# Altium project CPU_Board_V1_2.PrjPcb (part 2 of 2)

## Sheet Peripherial_Bus.SchDoc: Peripheral Bus
size Tabloid; Date: 03/13/2023; Engineer: Terry D. Schevker; Revision: 1.0; SheetNumber: 4; SheetTotal: 8
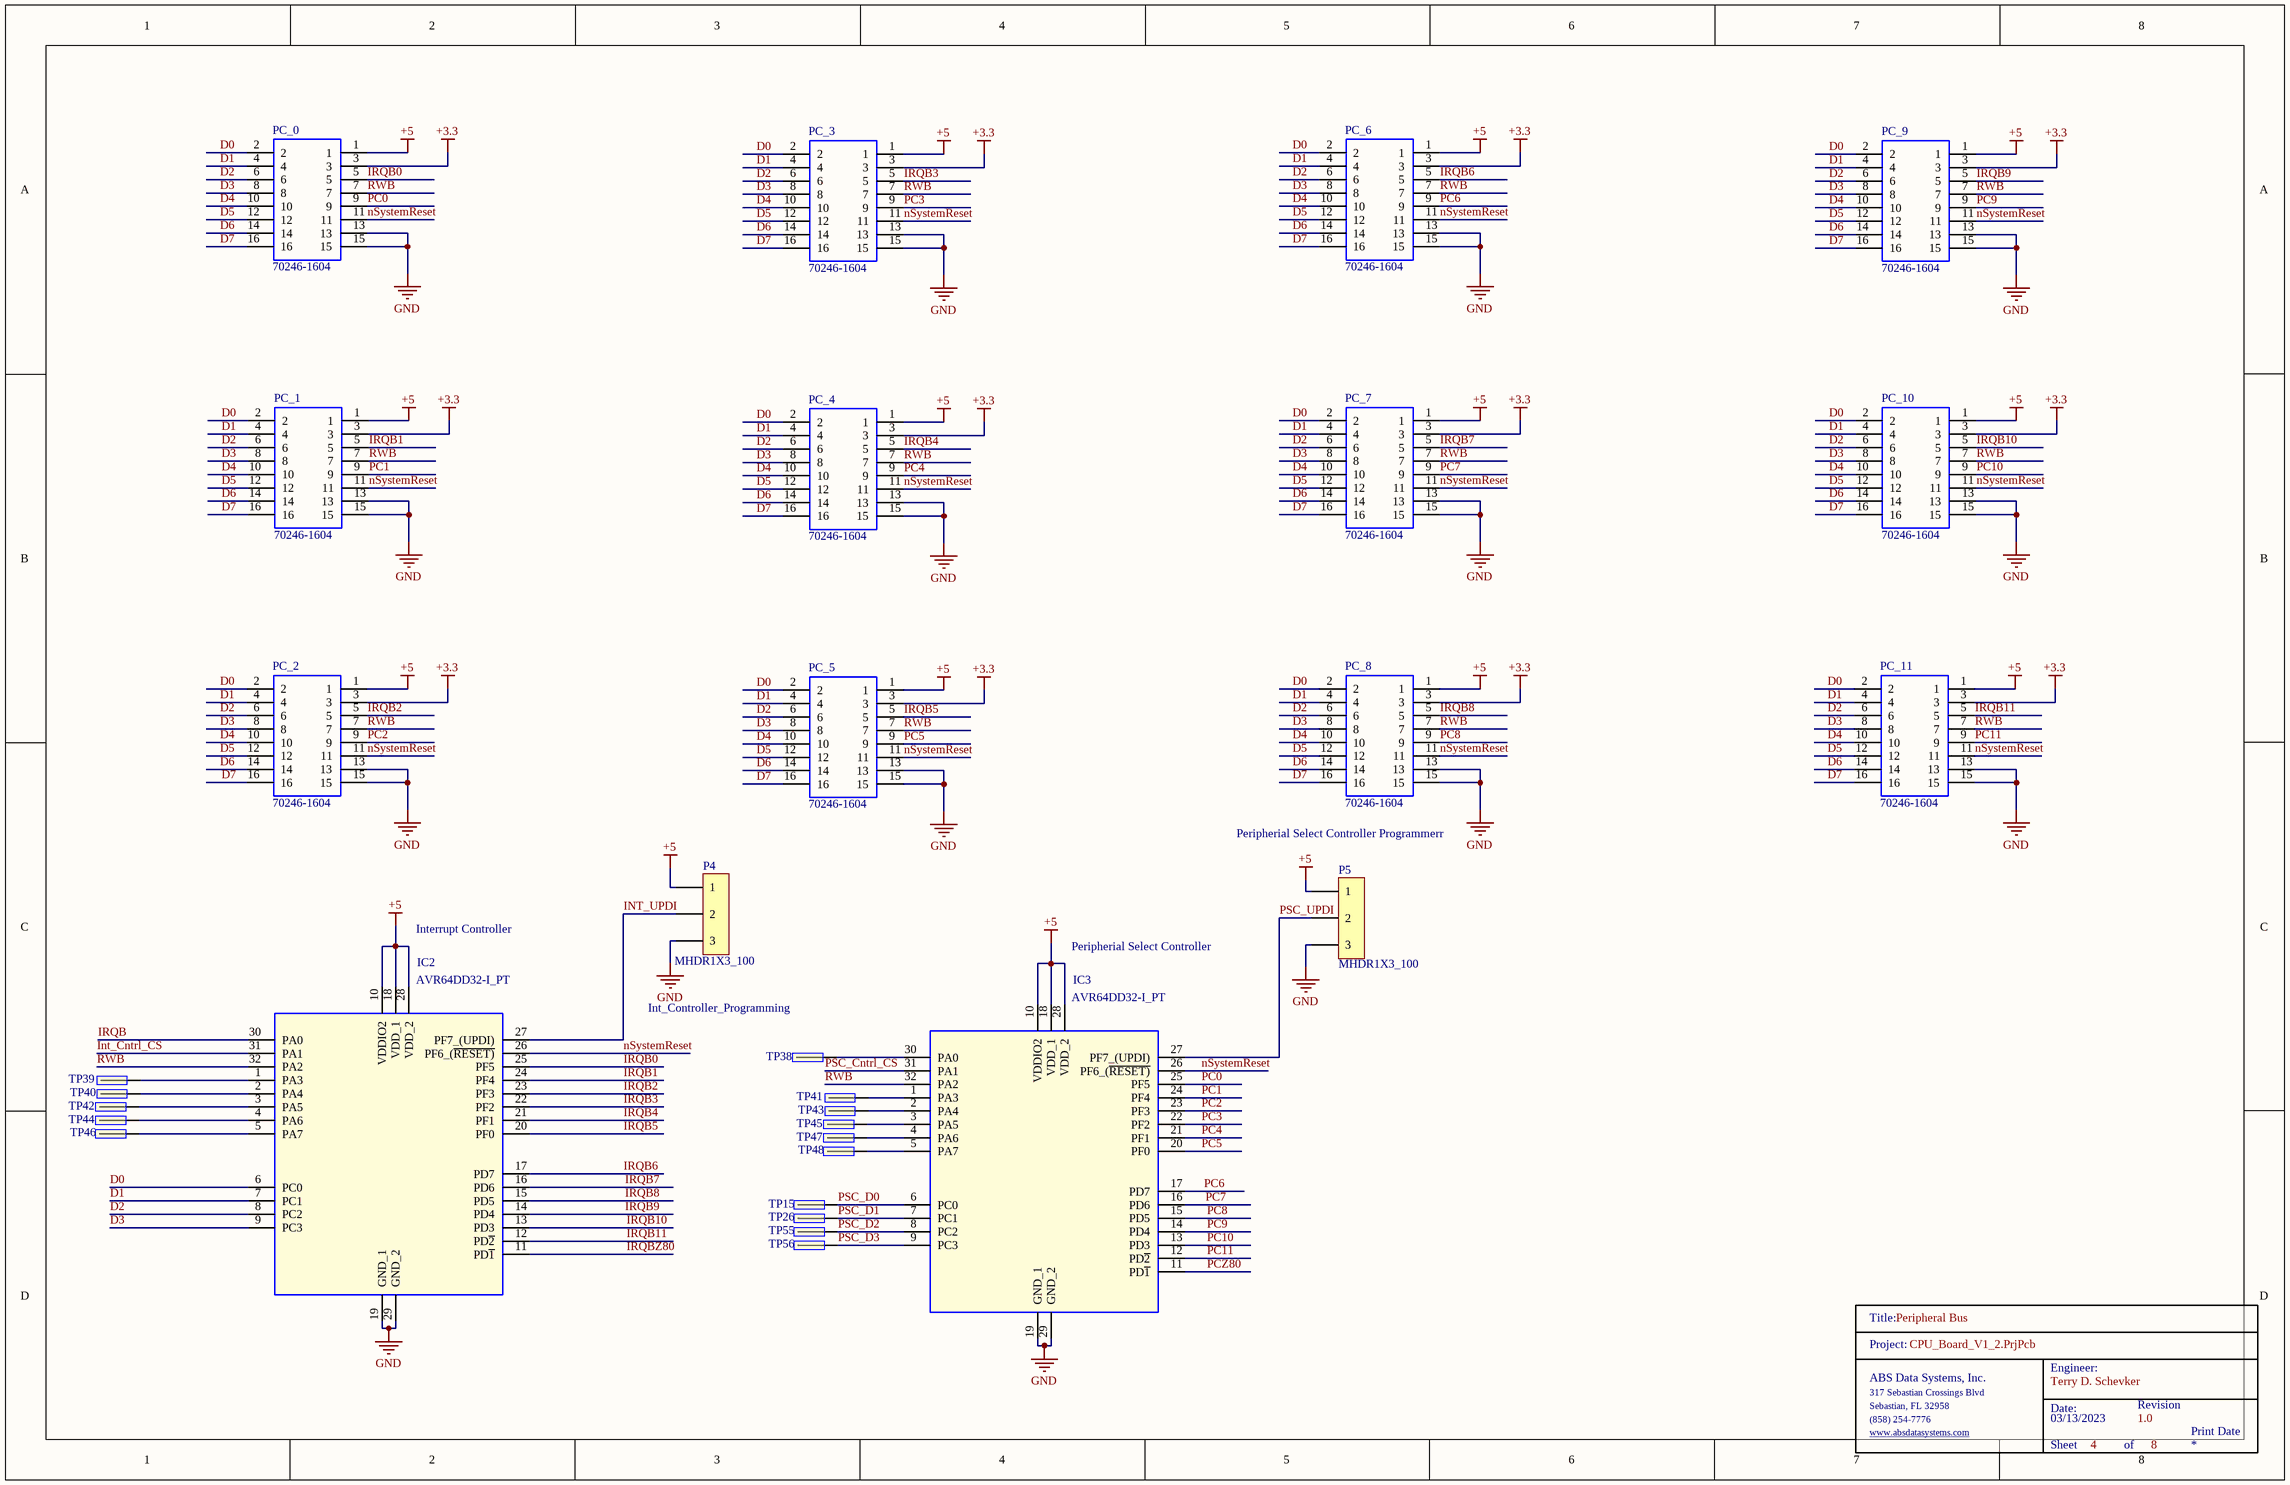
[diagram p3: Peripherial_Bus.SchDoc]

### Parts
(Parts that share a designator on the sheet are numbered #1, #2 ... from top to bottom, then left to right.)
IC2  AVR64DD32-I_PT  [QFP80P900X900X120-32N]
IC3  AVR64DD32-I_PT  [QFP80P900X900X120-32N]
P4  MHDR1X3_100  [MHDR1X3_100]
P5  MHDR1X3_100  [MHDR1X3_100]
PC_0  70246-1604  [SHDR16W99P254_2X8_2794X889X927P]
PC_1  70246-1604  [SHDR16W99P254_2X8_2794X889X927P]
PC_2  70246-1604  [SHDR16W99P254_2X8_2794X889X927P]
PC_3  70246-1604  [SHDR16W99P254_2X8_2794X889X927P]
PC_4  70246-1604  [SHDR16W99P254_2X8_2794X889X927P]
PC_5  70246-1604  [SHDR16W99P254_2X8_2794X889X927P]
PC_6  70246-1604  [SHDR16W99P254_2X8_2794X889X927P]
PC_7  70246-1604  [SHDR16W99P254_2X8_2794X889X927P]
PC_8  70246-1604  [SHDR16W99P254_2X8_2794X889X927P]
PC_9  70246-1604  [SHDR16W99P254_2X8_2794X889X927P]
PC_10  70246-1604  [SHDR16W99P254_2X8_2794X889X927P]
PC_11  70246-1604  [SHDR16W99P254_2X8_2794X889X927P]
TitleBlock_6#1  TitleBlock  (value not drawn)  (graphical)
TP15  TP  [TP]  (value not drawn)
TP26  TP  [TP]  (value not drawn)
TP38  TP  [TP]  (value not drawn)
TP39  TP  [TP]  (value not drawn)
TP40  TP  [TP]  (value not drawn)
TP41  TP  [TP]  (value not drawn)
TP42  TP  [TP]  (value not drawn)
TP43  TP  [TP]  (value not drawn)
TP44  TP  [TP]  (value not drawn)
TP45  TP  [TP]  (value not drawn)
TP46  TP  [TP]  (value not drawn)
TP47  TP  [TP]  (value not drawn)
TP48  TP  [TP]  (value not drawn)
TP55  TP  [TP]  (value not drawn)
TP56  TP  [TP]  (value not drawn)

### Nets
+3.3: PC_0.3 PC_1.3 PC_2.3 PC_3.3 PC_4.3 PC_5.3 PC_6.3 PC_7.3 PC_8.3 PC_9.3 PC_10.3 PC_11.3
+5: IC2.10(VDDIO2) IC2.18(VDD_1) IC2.28(VDD_2) IC3.10(VDDIO2) IC3.18(VDD_1) IC3.28(VDD_2) P4.1 P5.1 PC_0.1 PC_1.1 PC_2.1 PC_3.1 PC_4.1 PC_5.1 PC_6.1 PC_7.1 PC_8.1 PC_9.1 PC_10.1 PC_11.1
GND: IC2.19(GND_1) IC2.29(GND_2) IC3.19(GND_1) IC3.29(GND_2) P4.3 P5.3 PC_0.13 PC_0.15 PC_1.13 PC_1.15 PC_2.13 PC_2.15 PC_3.13 PC_3.15 PC_4.13 PC_4.15 PC_5.13 PC_5.15 PC_6.13 PC_6.15 PC_7.13 PC_7.15 PC_8.13 PC_8.15 PC_9.13 PC_9.15 PC_10.13 PC_10.15 PC_11.13 PC_11.15
D0: IC2.6(PC0) PC_0.2 PC_1.2 PC_2.2 PC_3.2 PC_4.2 PC_5.2 PC_6.2 PC_7.2 PC_8.2 PC_9.2 PC_10.2 PC_11.2
D1: IC2.7(PC1) PC_0.4 PC_1.4 PC_2.4 PC_3.4 PC_4.4 PC_5.4 PC_6.4 PC_7.4 PC_8.4 PC_9.4 PC_10.4 PC_11.4
D2: IC2.8(PC2) PC_0.6 PC_1.6 PC_2.6 PC_3.6 PC_4.6 PC_5.6 PC_6.6 PC_7.6 PC_8.6 PC_9.6 PC_10.6 PC_11.6
D3: IC2.9(PC3) PC_0.8 PC_1.8 PC_2.8 PC_3.8 PC_4.8 PC_5.8 PC_6.8 PC_7.8 PC_8.8 PC_9.8 PC_10.8 PC_11.8
D4: PC_0.10 PC_1.10 PC_2.10 PC_3.10 PC_4.10 PC_5.10 PC_6.10 PC_7.10 PC_8.10 PC_9.10 PC_10.10 PC_11.10
D5: PC_0.12 PC_1.12 PC_2.12 PC_3.12 PC_4.12 PC_5.12 PC_6.12 PC_7.12 PC_8.12 PC_9.12 PC_10.12 PC_11.12
D6: PC_0.14 PC_1.14 PC_2.14 PC_3.14 PC_4.14 PC_5.14 PC_6.14 PC_7.14 PC_8.14 PC_9.14 PC_10.14 PC_11.14
D7: PC_0.16 PC_1.16 PC_2.16 PC_3.16 PC_4.16 PC_5.16 PC_6.16 PC_7.16 PC_8.16 PC_9.16 PC_10.16 PC_11.16
Int_Cntrl_CS: IC2.31(PA1)
INT_UPDI: IC2.27(PF7_(UPDI)) P4.2
IRQB: IC2.30(PA0)
IRQB0: IC2.25(PF5) PC_0.5
IRQB1: IC2.24(PF4) PC_1.5
IRQB2: IC2.23(PF3) PC_2.5
IRQB3: IC2.22(PF2) PC_3.5
IRQB4: IC2.21(PF1) PC_4.5
IRQB5: IC2.20(PF0) PC_5.5
IRQB6: IC2.17(PD7) PC_6.5
IRQB7: IC2.16(PD6) PC_7.5
IRQB8: IC2.15(PD5) PC_8.5
IRQB9: IC2.14(PD4) PC_9.5
IRQB10: IC2.13(PD3) PC_10.5
IRQB11: IC2.12(PD~{2}) PC_11.5
IRQBZ80: IC2.11(PD~{1})
nSystemReset: IC2.26(PF6_(~{RESET)}) IC3.26(PF6_(~{RESET)}) PC_0.11 PC_1.11 PC_2.11 PC_3.11 PC_4.11 PC_5.11 PC_6.11 PC_7.11 PC_8.11 PC_9.11 PC_10.11 PC_11.11
PC0: IC3.25(PF5) PC_0.9
PC1: IC3.24(PF4) PC_1.9
PC2: IC3.23(PF3) PC_2.9
PC3: IC3.22(PF2) PC_3.9
PC4: IC3.21(PF1) PC_4.9
PC5: IC3.20(PF0) PC_5.9
PC6: IC3.17(PD7) PC_6.9
PC7: IC3.16(PD6) PC_7.9
PC8: IC3.15(PD5) PC_8.9
PC9: IC3.14(PD4) PC_9.9
PC10: IC3.13(PD3) PC_10.9
PC11: IC3.12(PD~{2}) PC_11.9
PCZ80: IC3.11(PD~{1})
PSC_Cntrl_CS: IC3.31(PA1)
PSC_D0: IC3.6(PC0) TP15.1
PSC_D1: IC3.7(PC1) TP26.1
PSC_D2: IC3.8(PC2) TP55.1
PSC_D3: IC3.9(PC3) TP56.1
PSC_UPDI: IC3.27(PF7_(UPDI)) P5.2
RWB: IC2.32(PA2) IC3.32(PA2) PC_0.7 PC_1.7 PC_2.7 PC_3.7 PC_4.7 PC_5.7 PC_6.7 PC_7.7 PC_8.7 PC_9.7 PC_10.7 PC_11.7
NetIC2_1: IC2.1(PA3) TP39.1
NetIC2_2: IC2.2(PA4) TP40.1
NetIC2_3: IC2.3(PA5) TP42.1
NetIC2_4: IC2.4(PA6) TP44.1
NetIC2_5: IC2.5(PA7) TP46.1
NetIC3_1: IC3.1(PA3) TP41.1
NetIC3_2: IC3.2(PA4) TP43.1
NetIC3_3: IC3.3(PA5) TP45.1
NetIC3_4: IC3.4(PA6) TP47.1
NetIC3_5: IC3.5(PA7) TP48.1
NetIC3_30: IC3.30(PA0) TP38.1

### Notes on the sheet
- Peripherial Select Controller Programmerr
- Interrupt Controller
- Peripherial Select Controller
- Int_Controller_Programming
- Print Date
- (in symbol TitleBlock) Title:; Project:; Engineer:; ABS Data Systems, Inc.; 317 Sebastian Crossings Blvd; Sebastian, FL 32958; Date:; Revision; (858) 254-7776; www.absdatasystems.com; Sheet; of

### Library data of the parts
IC2 IC3 = AVR64DD32-I_PT: Integrated Circuit; Manufacturer_Name: Microchip; Manufacturer_Part_Number: AVR64DD32-I/PT | MULTI-VOLTAGE I/O; Datasheet Link: https://www.microchip.com/en-us/product/AVR64DD32; Height: 1.2mm
P4 P5 = MHDR1X3_100: Header, 3-Pin; LatestRevisionDate: 17-Jul-2002; LatestRevisionNote: Re-released for DXP Platform.; Publisher: Altium Limited
PC_0-PC_11 = 70246-1604: Molex C-GRID 70246, 2.54mm Pitch, 16 Way, 2 Row, Straight PCB Header, Through Hole; Geometry.Height: 9.27mm; Mouser Part Number: 538-70246-1604; Mouser Price/Stock: https://www.mouser.co.uk/ProductDetail/Molex/70246-1604?qs=KUIzHt%2Fe91njhb67Cjmalw%3D%3D; Manufacturer_Name: Molex; Manufacturer_Part_Number: 70246-1604; Datasheet Link: https://www.molex.com/pdm_docs/sd/702461604_sd.pdf
TP15 TP26 TP38-TP48 TP55 TP56 = TP: Manufacturer: Samtec; Manufacturer Part Number: TST-105-01-G-D; Number of Contacts: 16; Gender: Male; Connector Type: Male Pin; Pitch: 2.54mm; Row Spacing: 0.1inch; Supplier 1: Digi-Key; RoHS: Yes; Category: Headers and Wire Housings; Stock 1: 227; Pricing 1: 1=2.85000, 10=2.73600, 100=2.28000, 500=1.93800, 1000=1.65300, 5000=1.48200 (USD); Mount: Through Hole; Contact Plating: Gold; Contact Material: Bronze; Housing Material: Polyester; Housing Color: Black; Color: Black; Min Operating Temperature: -55°C; Max Operating Temperature: 125°C; Number of Rows: 2; Termination: Solder; Packaging: Rail/Tube; Orientation: Straight; Number of Positions: 16; Length: 27.94mm; Depth: 9.27mm; Contact Mating Length: 0.25inch; REACH SVHC: No SVHC; ComponentLink1URL: https://datasheet.ciiva.com/739/tst-mkt-739845.pdf?src-supplier=Digi-Key; ComponentLink1Description: https://datasheet.ciiva.com/739/tst-mkt-739845.pdf?src-supplier=Digi-Key; ComponentLink2URL: https://datasheet.ciiva.com/10018/htst-10018510.pdf?src-supplier=Avnet; ComponentLink2Description: https://datasheet.ciiva.com/10018/htst-10018510.pdf?src-supplier=Avnet

## Sheet PowerSupply.SchDoc: Power Board
size Tabloid; Date: 12/20/2022; Engineer: Terry D. Schevker; Revision: 1.0; SheetNumber: 5; SheetTotal: 8
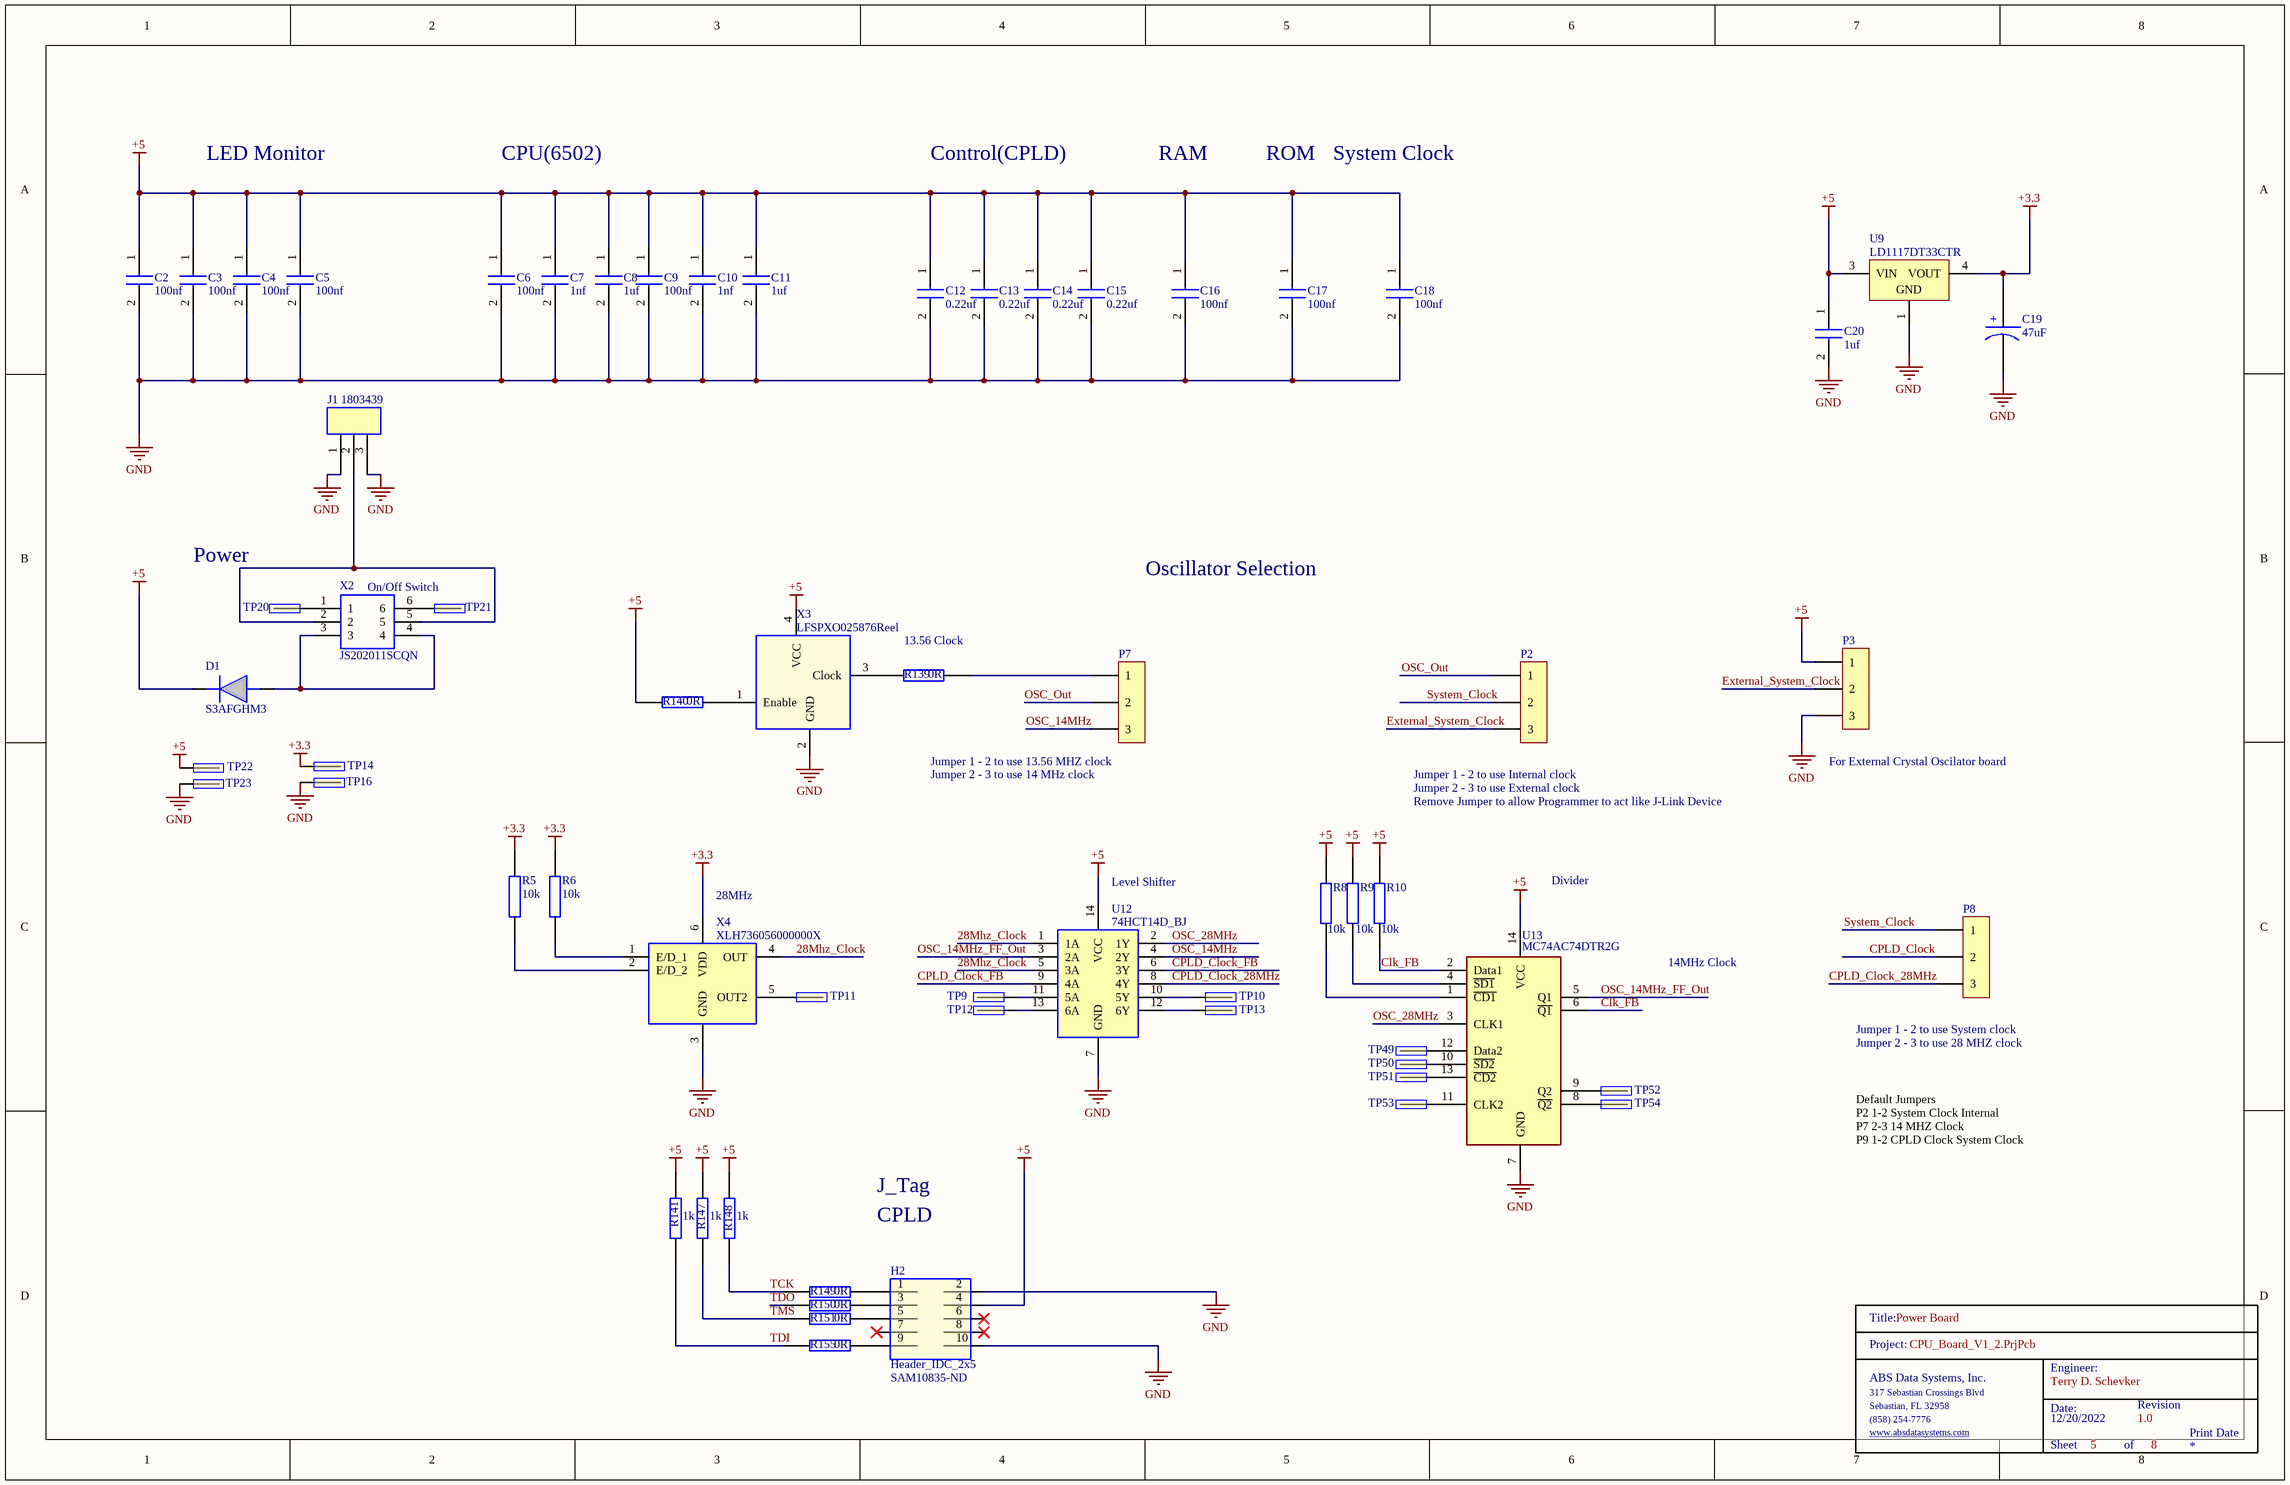
[diagram p4: PowerSupply.SchDoc]

### Parts
C2  100nf  [0603]
C3  100nf  [0603]
C4  100nf  [0603]
C5  100nf  [0603]
C6  100nf  [0603]
C7  1nf  [0603]
C8  1uf  [0603]
C9  100nf  [0603]
C10  1nf  [0603]
C11  1uf  [0603]
C12  0.22uf  [0603]
C13  0.22uf  [0603]
C14  0.22uf  [0603]
C15  0.22uf  [0603]
C16  100nf  [0603]
C17  100nf  [0603]
C18  100nf  [0603]
C19  47uF  [CapSMD_6.3x5.8]
C20  1uf  [0603]
D1  S3AFGHM3  [do-221ac]
H2  Header_IDC_2x5  Supplier Part Number 1: SAM10835-ND  [HDR2X5]
J1  1803439  [1803439]
P2  MHDR1X3_100  [MHDR1X3_100]  (value not drawn)
P3  MHDR1X3_100  [MHDR1X3_100]  (value not drawn)
P7  MHDR1X3_100  [MHDR1X3_100]  (value not drawn)
P8  MHDR1X3_100  [MHDR1X3_100]  (value not drawn)
R5  10k  [0603]
R6  10k  [0603]
R8  10k  [0603]
R9  10k  [0603]
R10  10k  [0603]
R139  0R  [0603]
R140  0R  [0603]
R141  1k  [0603]
R147  1k  [0603]
R148  1k  [0603]
R149  0R  [0603]
R150  0R  [0603]
R151  0R  [0603]
R155  0R  [0603]
TitleBlock_3  TitleBlock  (value not drawn)  (graphical)
TP9  (no value)  [TP]
TP10  TP  [TP]  (value not drawn)
TP11  TP  [TP]  (value not drawn)
TP12  (no value)  [TP]
TP13  TP  [TP]  (value not drawn)
TP14  TP  [TP]  (value not drawn)
TP16  TP  [TP]  (value not drawn)
TP20  (no value)  [TP]
TP21  (no value)  [TP]
TP22  TP  [TP]  (value not drawn)
TP23  TP  [TP]  (value not drawn)
TP49  TP  [TP]  (value not drawn)
TP50  TP  [TP]  (value not drawn)
TP51  TP  [TP]  (value not drawn)
TP52  TP  [TP]  (value not drawn)
TP53  TP  [TP]  (value not drawn)
TP54  TP  [TP]  (value not drawn)
U9  LD1117DT33CTR  [TO-252_N]
U12  74HCT14D_BJ  [SOIC127P600X175-14N]
U13  MC74AC74DTR2G  [SOP65P640X120-14N]
X2  JS202011SCQN  [JS202011SCQN]
X3  LFSPXO025876Reel  [LFSPXO025876Reel]
X4  XLH736056000000X  [XLH736056000000X]

### Nets
+3.3: C19.1 R5.2 R6.2 TP14.1 U9.4(VOUT) X4.6(VDD)
+5: C2.1 C3.1 C4.1 C5.1 C6.1 C7.1 C8.1 C9.1 C10.1 C11.1 C12.1 C13.1 C14.1 C15.1 C16.1 C17.1 C18.1 C20.1 D1.1(K) H2.4 P3.1 R8.2 R9.2 R10.2 R140.1 R141.1 R147.1 R148.1 TP22.1 U9.3(VIN) U12.14(VCC) U13.14(VCC) X3.4(VCC)
GND: C2.2 C3.2 C4.2 C5.2 C6.2 C7.2 C8.2 C9.2 C10.2 C11.2 C12.2 C13.2 C14.2 C15.2 C16.2 C17.2 C18.2 C19.2 C20.2 H2.2 H2.10 J1.1 J1.3 P3.3 TP16.1 TP23.1 U9.1(GND) U12.7(GND) U13.7(GND) X3.2(GND) X4.3(GND)
28Mhz_Clock: U12.1(1A) U12.5(3A) X4.4(OUT)
Clk_FB: R10.1 U13.2(Data1) U13.6(~{Q1})
CPLD_Clock: P8.2
CPLD_Clock_28MHz: P8.3 U12.8(4Y)
CPLD_Clock_FB: U12.6(3Y) U12.9(4A)
External_System_Clock: P2.3 P3.2
OSC_14MHz: P7.3 U12.4(2Y)
OSC_14MHz_FF_Out: U12.3(2A) U13.5(Q1)
OSC_28MHz: U12.2(1Y) U13.3(CLK1)
OSC_Out: P2.1 P7.2
System_Clock: P2.2 P8.1
TCK: R148.2 R149.1
TDI: R141.2 R155.1
TDO: R150.1
TMS: R147.2 R151.1
NetD1_2: D1.2(A) X2.3 X2.4
NetH2_1: H2.1 R149.2
NetH2_3: H2.3 R150.2
NetH2_5: H2.5 R151.2
NetH2_9: H2.9 R155.2
NetJ1_2: J1.2 X2.2 X2.5
NetP7_1: P7.1 R139.2
NetR5_1: R5.1 X4.2(E/D_2)
NetR6_1: R6.1 X4.1(E/D_1)
NetR8_1: R8.1 U13.1(~{CD1})
NetR9_1: R9.1 U13.4(~{SD1})
NetR139_1: R139.1 X3.3(Clock)
NetR140_2: R140.2 X3.1(Enable)
NetTP9_1: TP9.1 U12.11(5A)
NetTP10_1: TP10.1 U12.10(5Y)
NetTP11_1: TP11.1 X4.5(OUT2)
NetTP12_1: TP12.1 U12.13(6A)
NetTP13_1: TP13.1 U12.12(6Y)
NetTP20_1: TP20.1 X2.1
NetTP21_1: TP21.1 X2.6
NetTP49_1: TP49.1 U13.12(Data2)
NetTP50_1: TP50.1 U13.10(~{SD2})
NetTP51_1: TP51.1 U13.13(~{CD2})
NetTP52_1: TP52.1 U13.9(Q2)
NetTP53_1: TP53.1 U13.11(CLK2)
NetTP54_1: TP54.1 U13.8(~{Q2})

Not connected (* = marked no-connect by the designer): H2 6* 7* 8*

### Notes on the sheet
- LED Monitor
- CPU(6502)
- Control(CPLD)
- RAM
- ROM
- System Clock
- (near TP20) Power
- On/Off Switch
- Oscillator Selection
- (near R139) 13.56 Clock
- (near P7) Jumper 1 - 2 to use 13.56 MHZ clock
- (near P3) For External Crystal Oscilator board
- (near P7) Jumper 2 - 3 to use 14 MHz clock
- (near P2) Jumper 1 - 2 to use Internal clock
- Remove Jumper to allow Programmer to act like J-Link Device
- Jumper 2 - 3 to use External clock
- (near X4) 28MHz
- (near U12) Level Shifter
- Divider
- 14MHz Clock
- (near P8) Jumper 1 - 2 to use System clock
- Jumper 2 - 3 to use 28 MHZ clock
- Default Jumpers
  P2 1-2 System Clock Internal
  P7 2-3 14 MHZ Clock
  P9 1-2 CPLD Clock System Clock
- J_Tag
- CPLD
- Print Date
- (in symbol TitleBlock) Title:; Project:; Engineer:; ABS Data Systems, Inc.; 317 Sebastian Crossings Blvd; Sebastian, FL 32958; Date:; Revision; (858) 254-7776; www.absdatasystems.com; Sheet; of
- (in symbol UUD1C470MCL1GS) +

### Library data of the parts
C2-C6 C9 C12-C18 = CL10B104JB8NNNC: Samsung Electro-Mechanics 0603 100nf
C7 C10 = CL10B102KB8NNNL: Samsung Electro-Mechanics 0603 1nf
C8 C11 C20 = CL10B105KA8NNNL: Samsung Electro-Mechanics 0603 1uf
C19 = UUD1C470MCL1GS: CAP ALUM 47UF 20% 16V SMD; Manufacturer: Nichicon; Dielectric Material: Aluminium; Ripple Current: 230mA; Impedance: 440mR; Leakage Current: 3uA; Life (Hours): 2000Hour; Dissipation Factor: 0.2%; Lead Diameter: 0.8mm; Supplier 1: Digi-Key; Manufacturer Part Number: UUD1C470MCL1GS; RoHS: Yes; Category: Aluminum Electrolytic Capacitors; Stock 1: 26327; Pricing 1: 1=0.50000, 10=0.34600, 50=0.24220, 100=0.20760, 500=0.15568 (USD); Case/Package: Radial; Number of Pins: 2; Contact Plating: Tin; Min Operating Temperature: -55°C; Max Operating Temperature: 105°C; Tolerance: 20%; Capacitance: 47uF; Package Quantity: 1000; Voltage Rating (DC): 16V; Packaging: Tape and Reel; Voltage Rating: 16V; Ripple Current (AC): 230mA; Termination: SMD/SMT; Voltage: 16V; Diameter: 6.3mm; Length: 5.8mm; Height: 5.8mm; Lead Pitch: 2.2mm; Height - Seated (Max): 0.228inch; Radiation Hardening: No; REACH SVHC: No SVHC; Lead Free: Lead Free; ComponentLink1URL: https://datasheet.ciiva.com/30522/getdatasheetpartid-449848-30522051.pdf?src-supplier=Verical; ComponentLink1Description: https://datasheet.ciiva.com/30522/getdatasheetpartid-449848-30522051.pdf?src-supplier=Verical; ComponentLink2URL: https://datasheet.ciiva.com/96/e-ud-96997.pdf?src-supplier=Digi-Key; ComponentLink2Description: https://datasheet.ciiva.com/96/e-ud-96997.pdf?src-supplier=Digi-Key; ComponentLink3URL: https://datasheet.ciiva.com/11776/0900766b80fa39e7-11776889.pdf?src-supplier=RSComponents; ComponentLink3Description: https://datasheet.ciiva.com/11776/0900766b80fa39e7-11776889.pdf?src-supplier=RSComponents; ComponentLink4URL: https://datasheet.ciiva.com/96/e-ud-96998.pdf?src-supplier=Digi-Key; ComponentLink4Description: https://datasheet.ciiva.com/96/e-ud-96998.pdf?src-supplier=Digi-Key; ComponentLink5URL: https://datasheet.ciiva.com/96/e-ud-96999.pdf?src-supplier=Digi-Key; ComponentLink5Description: https://datasheet.ciiva.com/96/e-ud-96999.pdf?src-supplier=Digi-Key; ComponentLink6URL: https://datasheet.ciiva.com/11686/e-ud-11686236.pdf?src-supplier=Avnet; ComponentLink6Description: https://datasheet.ciiva.com/11686/e-ud-11686236.pdf?src-supplier=Avnet; ComponentLink7URL: https://datasheet.ciiva.com/16502/e-ud-16502750.pdf?src-supplier=Future+Electronics; ComponentLink7Description: https://datasheet.ciiva.com/16502/e-ud-16502750.pdf?src-supplier=Future+Electronics; ComponentLink8URL: https://datasheet.ciiva.com/7781/e-ud-7781695.pdf?src-supplier=Element14; ComponentLink8Description: https://datasheet.ciiva.com/7781/e-ud-7781695.pdf?src-supplier=Element14; Supplier Part Number 1: 493-2259-1-ND
D1 = S3AFGHM3/I: Rectifiers VR=400V, IO=3A; Manufacturer_Name: Comchip Technology; Manufacturer_Part_Number: 1N4001-G; Mouser Part Number: 750-1N4001-G; Mouser Price/Stock: https://www.mouser.co.uk/ProductDetail/Comchip-Technology/1N4001-G?qs=2qJf6qQ4IOKJYZQUWvVExw%3D%3D; Datasheet Link: https://datasheet.datasheetarchive.com/originals/distributors/Datasheets-7/DSA-138621.pdf
H2 = Header_IDC_2x5: 10 Pin 2x5 Through Hold IDC Connector; Manufacturer: Samtec; Manufacturer Part Number: TST-105-01-G-D; Number of Contacts: 16; Gender: Male; Connector Type: Male Pin; Pitch: 2.54mm; Row Spacing: 0.1inch; Supplier 1: Digi-Key; RoHS: Yes; Category: Headers and Wire Housings; Stock 1: 227; Pricing 1: 1=2.85000, 10=2.73600, 100=2.28000, 500=1.93800, 1000=1.65300, 5000=1.48200 (USD); Mount: Through Hole; Contact Plating: Gold; Contact Material: Bronze; Housing Material: Polyester; Housing Color: Black; Color: Black; Min Operating Temperature: -55°C; Max Operating Temperature: 125°C; Number of Rows: 2; Termination: Solder; Packaging: Rail/Tube; Orientation: Straight; Number of Positions: 16; Length: 27.94mm; Depth: 9.27mm; Contact Mating Length: 0.25inch; REACH SVHC: No SVHC; ComponentLink1URL: https://datasheet.ciiva.com/739/tst-mkt-739845.pdf?src-supplier=Digi-Key; ComponentLink1Description: https://datasheet.ciiva.com/739/tst-mkt-739845.pdf?src-supplier=Digi-Key; ComponentLink2URL: https://datasheet.ciiva.com/10018/htst-10018510.pdf?src-supplier=Avnet; ComponentLink2Description: https://datasheet.ciiva.com/10018/htst-10018510.pdf?src-supplier=Avnet
J1 = 1803439: Connector; Manufacturer_Name: Phoenix Contact; Datasheet Link: http://uk.rs-online.com/web/p/products/2204838; Manufacturer_Part_Number: 1803439; Mouser Part Number: 651-1803439; Mouser Price/Stock: https://www.mouser.co.uk/ProductDetail/Phoenix-Contact/1803439?qs=ChwaSN6Xm4%2FKqu7eZUAe4w%3D%3D; Arrow Part Number: 1803439; Arrow Price/Stock: https://www.arrow.com/en/products/1803439/phoenix-contact?region=nac
P2 P3 P7 P8 = MHDR1X3_100: Header, 3-Pin; LatestRevisionDate: 17-Jul-2002; LatestRevisionNote: Re-released for DXP Platform.; Publisher: Altium Limited
R5 R6 R8-R10 = RC0603JR-0710KL: YAGEO 0603 10k ohm; Manufacturer_Name: KEMET; Manufacturer_Part_Number: RC0603JR-070RL; Geometry.Height: 0.55mm; Mouser Part Number: 603-RC0603JR-070RL; Mouser Price/Stock: https://www.mouser.co.uk/ProductDetail/YAGEO/RC0603JR-070RL?qs=2cAdsCoAWRGWyPcuXgGiXQ%3D%3D; Datasheet Link: https://datasheet.datasheetarchive.com/originals/distributors/Datasheets_SAMA/902f9e387b938f871d31120f5fc1d65e.pdf
R139 R140 R149-R151 R155 = RC0603JR-070RL: YAGEO 0603 0 ohm; Manufacturer_Name: KEMET; Geometry.Height: 0.55mm; Mouser Part Number: 603-RC0603JR-070RL; Mouser Price/Stock: https://www.mouser.co.uk/ProductDetail/YAGEO/RC0603JR-070RL?qs=2cAdsCoAWRGWyPcuXgGiXQ%3D%3D; Manufacturer_Part_Number: RC0603JR-070RL; Datasheet Link: https://datasheet.datasheetarchive.com/originals/distributors/Datasheets_SAMA/902f9e387b938f871d31120f5fc1d65e.pdf
R141 R147 R148 = AC0603FR-7W1KL: YAGEO 0603 1k ohm; Manufacturer_Name: KEMET; Manufacturer_Part_Number: RC0603JR-070RL; Geometry.Height: 0.55mm; Mouser Part Number: 603-RC0603JR-070RL; Mouser Price/Stock: https://www.mouser.co.uk/ProductDetail/YAGEO/RC0603JR-070RL?qs=2cAdsCoAWRGWyPcuXgGiXQ%3D%3D; Datasheet Link: https://datasheet.datasheetarchive.com/originals/distributors/Datasheets_SAMA/902f9e387b938f871d31120f5fc1d65e.pdf
TP9-TP14 TP16 TP20-TP23 TP49-TP54 = TP: as TP15 on sheet Peripherial_Bus; Supplier 1: Digi-Key; RoHS: Yes; Category: Headers and Wire Housings; Stock 1: 227; Pricing 1: 1=2.85000, 10=2.73600, 100=2.28000, 500=1.93800, 1000=1.65300, 5000=1.48200 (USD); Mount: Through Hole; Contact Plating: Gold; Contact Material: Bronze; Housing Material: Polyester; Housing Color: Black; Color: Black; Min Operating Temperature: -55°C; Max Operating Temperature: 125°C; Number of Rows: 2; Termination: Solder; Packaging: Rail/Tube; Orientation: Straight; Number of Positions: 16; Length: 27.94mm; Depth: 9.27mm; Contact Mating Length: 0.25inch; REACH SVHC: No SVHC; ComponentLink1URL: https://datasheet.ciiva.com/739/tst-mkt-739845.pdf?src-supplier=Digi-Key; ComponentLink1Description: https://datasheet.ciiva.com/739/tst-mkt-739845.pdf?src-supplier=Digi-Key; ComponentLink2URL: https://datasheet.ciiva.com/10018/htst-10018510.pdf?src-supplier=Avnet; ComponentLink2Description: https://datasheet.ciiva.com/10018/htst-10018510.pdf?src-supplier=Avnet
U9 = PM-REG-LD1117-SOT3: 3.3V Voltage Regulator SMD; PackageVersion: 2011; ComponentLink1URL: http://www.st.com; DatasheetVersion: 1/11/2011; PackageReference: TO-252; ComponentLink1Description: Manufacturer URL; ComponentLink2URL: http://www.st.com/internet/com/TECHNICAL_RESOURCES/TECHNICAL_LITERATURE/DATASHEET/CD00000544.pdf; ComponentLink2Description: Datasheet; PackageDescription: 3-Pin Transistor Outline Package 2.28 mm Pitch, 9.7 mm Lead Span (DPAK)
U12 = 74HCT14D_BJ: Inveter
U13 = MC74AC74DTR2G: FlipFlop
X2 = JS202011SCQN: Sub miniature slide switches; Manufacturer_Name: C & K COMPONENTS; Geometry.Height: 5.5mm; Mouser Part Number: 611-JS202011SCQN; Mouser Price/Stock: https://www.mouser.co.uk/ProductDetail/CK/JS202011SCQN?qs=LgMIjt8LuD95JYWxZ7NvZA%3D%3D; Manufacturer_Part_Number: JS202011SCQN; Datasheet Link: http://www.ckswitches.com/media/1422/js.pdf
X3 = LFSPXO025876Reel: Standard Clock Oscillators 13.56MHz 5V 100ppm -40C +85C; Manufacturer_Name: IQD; Geometry.Height: 1.4mm; Mouser Part Number: 449-LFSPXO025876REEL; Mouser Price/Stock: https://www.mouser.co.uk/ProductDetail/IQD/LFSPXO025876Reel?qs=e4%2FAndAAwgKQk%252Bo7MiilFg%3D%3D; Manufacturer_Part_Number: LFSPXO025876Reel; Datasheet Link: https://componentsearchengine.com/Datasheets/1/LFSPXO025876Reel.pdf
X4 = XLH736056000000X: Crystall Oscillator

## Sheet Programmer_Interface.SchDoc: Programmer Interface
size Tabloid; Date: 02/08/2023; Engineer: Terry D. schevker; Revision: 1.0; SheetNumber: 6; SheetTotal: 8
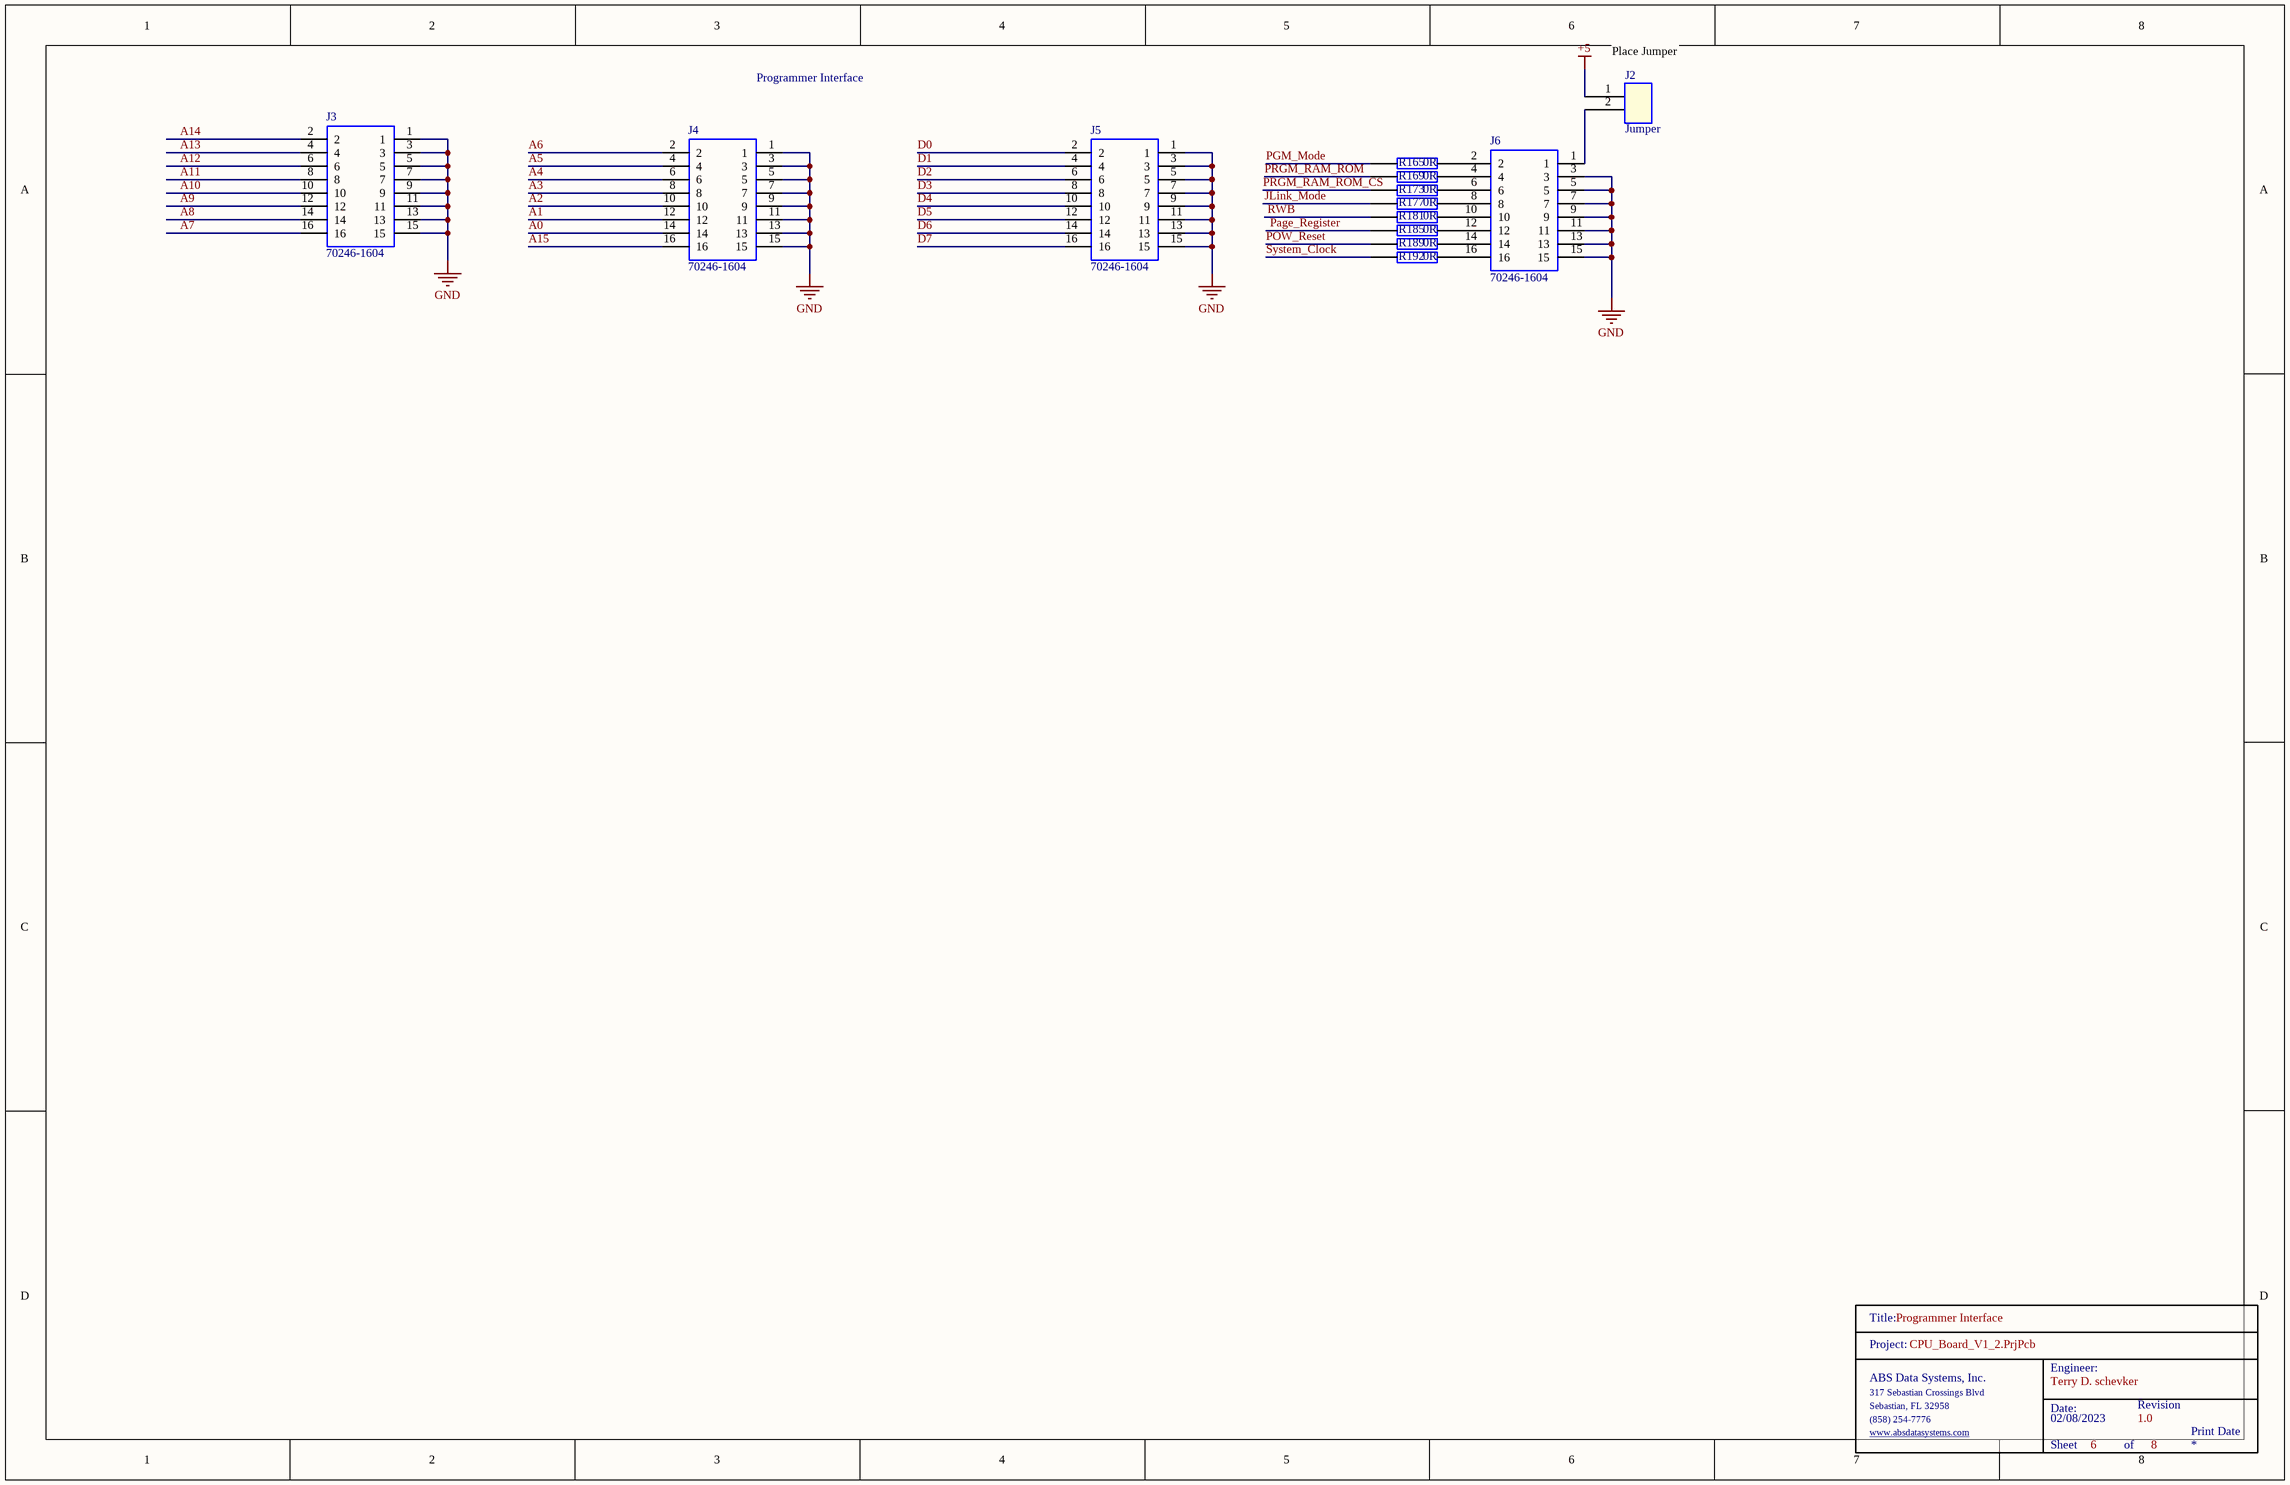
[diagram p5: Programmer_Interface.SchDoc]

### Parts
J2  Jumper  [Jumper]
J3  70246-1604  [SHDR16W99P254_2X8_2794X889X927P]
J4  70246-1604  [SHDR16W99P254_2X8_2794X889X927P]
J5  70246-1604  [SHDR16W99P254_2X8_2794X889X927P]
J6  70246-1604  [SHDR16W99P254_2X8_2794X889X927P]
R165  0R  [0603]
R169  0R  [0603]
R173  0R  [0603]
R177  0R  [0603]
R181  0R  [0603]
R185  0R  [0603]
R189  0R  [0603]
R192  0R  [0603]
TitleBlock_4  TitleBlock  (value not drawn)  (graphical)

### Nets
+5: J2.1
GND: J3.1 J3.3 J3.5 J3.7 J3.9 J3.11 J3.13 J3.15 J4.1 J4.3 J4.5 J4.7 J4.9 J4.11 J4.13 J4.15 J5.1 J5.3 J5.5 J5.7 J5.9 J5.11 J5.13 J5.15 J6.3 J6.5 J6.7 J6.9 J6.11 J6.13 J6.15
A0: J4.14
A1: J4.12
A2: J4.10
A3: J4.8
A4: J4.6
A5: J4.4
A6: J4.2
A7: J3.16
A8: J3.14
A9: J3.12
A10: J3.10
A11: J3.8
A12: J3.6
A13: J3.4
A14: J3.2
A15: J4.16
D0: J5.2
D1: J5.4
D2: J5.6
D3: J5.8
D4: J5.10
D5: J5.12
D6: J5.14
D7: J5.16
JLink_Mode: R177.1
Page_Register: R185.1
PGM_Mode: R165.1
POW_Reset: R189.1
PRGM_RAM_ROM: R169.1
PRGM_RAM_ROM_CS: R173.1
RWB: R181.1
System_Clock: R192.1
NetJ2_2: J2.2 J6.1
NetJ6_2: J6.2 R165.2
NetJ6_4: J6.4 R169.2
NetJ6_6: J6.6 R173.2
NetJ6_8: J6.8 R177.2
NetJ6_10: J6.10 R181.2
NetJ6_12: J6.12 R185.2
NetJ6_14: J6.14 R189.2
NetJ6_16: J6.16 R192.2

### Notes on the sheet
- Programmer Interface
- (near J2) Place Jumper on to use the 5V power supply from the Peripheral board.
- Print Date
- (in symbol TitleBlock) Title:; Project:; Engineer:; ABS Data Systems, Inc.; 317 Sebastian Crossings Blvd; Sebastian, FL 32958; Date:; Revision; (858) 254-7776; www.absdatasystems.com; Sheet; of

### Library data of the parts
J2 = Jumper: 16 Pin 3x8 Through Hold Jumprts; Manufacturer: Samtec; Manufacturer Part Number: TST-108-01-G-D; Number of Contacts: 16; Gender: Male; Connector Type: Male Pin; Pitch: 2.54mm; Row Spacing: 0.1inch; Supplier 1: Digi-Key; RoHS: Yes; Category: Headers and Wire Housings; Stock 1: 227; Pricing 1: 1=2.85000, 10=2.73600, 100=2.28000, 500=1.93800, 1000=1.65300, 5000=1.48200 (USD); Mount: Through Hole; Contact Plating: Gold; Contact Material: Bronze; Housing Material: Polyester; Housing Color: Black; Color: Black; Min Operating Temperature: -55°C; Max Operating Temperature: 125°C; Number of Rows: 2; Termination: Solder; Packaging: Rail/Tube; Orientation: Straight; Number of Positions: 16; Length: 27.94mm; Depth: 9.27mm; Contact Mating Length: 0.25inch; REACH SVHC: No SVHC; ComponentLink1URL: https://datasheet.ciiva.com/739/tst-mkt-739845.pdf?src-supplier=Digi-Key; ComponentLink1Description: https://datasheet.ciiva.com/739/tst-mkt-739845.pdf?src-supplier=Digi-Key; ComponentLink2URL: https://datasheet.ciiva.com/10018/htst-10018510.pdf?src-supplier=Avnet; ComponentLink2Description: https://datasheet.ciiva.com/10018/htst-10018510.pdf?src-supplier=Avnet
J3-J6 = 70246-1604: as PC_0 on sheet Peripherial_Bus; Mouser Part Number: 538-70246-1604; Mouser Price/Stock: https://www.mouser.co.uk/ProductDetail/Molex/70246-1604?qs=KUIzHt%2Fe91njhb67Cjmalw%3D%3D; Manufacturer_Name: Molex; Manufacturer_Part_Number: 70246-1604; Datasheet Link: https://www.molex.com/pdm_docs/sd/702461604_sd.pdf
R165 R169 R173 R177 R181 R185 R189 R192 = RC0603JR-070RL: as R139 on sheet PowerSupply; Mouser Part Number: 603-RC0603JR-070RL; Mouser Price/Stock: https://www.mouser.co.uk/ProductDetail/YAGEO/RC0603JR-070RL?qs=2cAdsCoAWRGWyPcuXgGiXQ%3D%3D; Manufacturer_Part_Number: RC0603JR-070RL; Datasheet Link: https://datasheet.datasheetarchive.com/originals/distributors/Datasheets_SAMA/902f9e387b938f871d31120f5fc1d65e.pdf

## Sheet TestPoints.SchDoc: Test Points
size Tabloid; Date: 02/08/2023; Engineer: Terry D. Schevker; Revision: 1.0; SheetNumber: 7; SheetTotal: 8
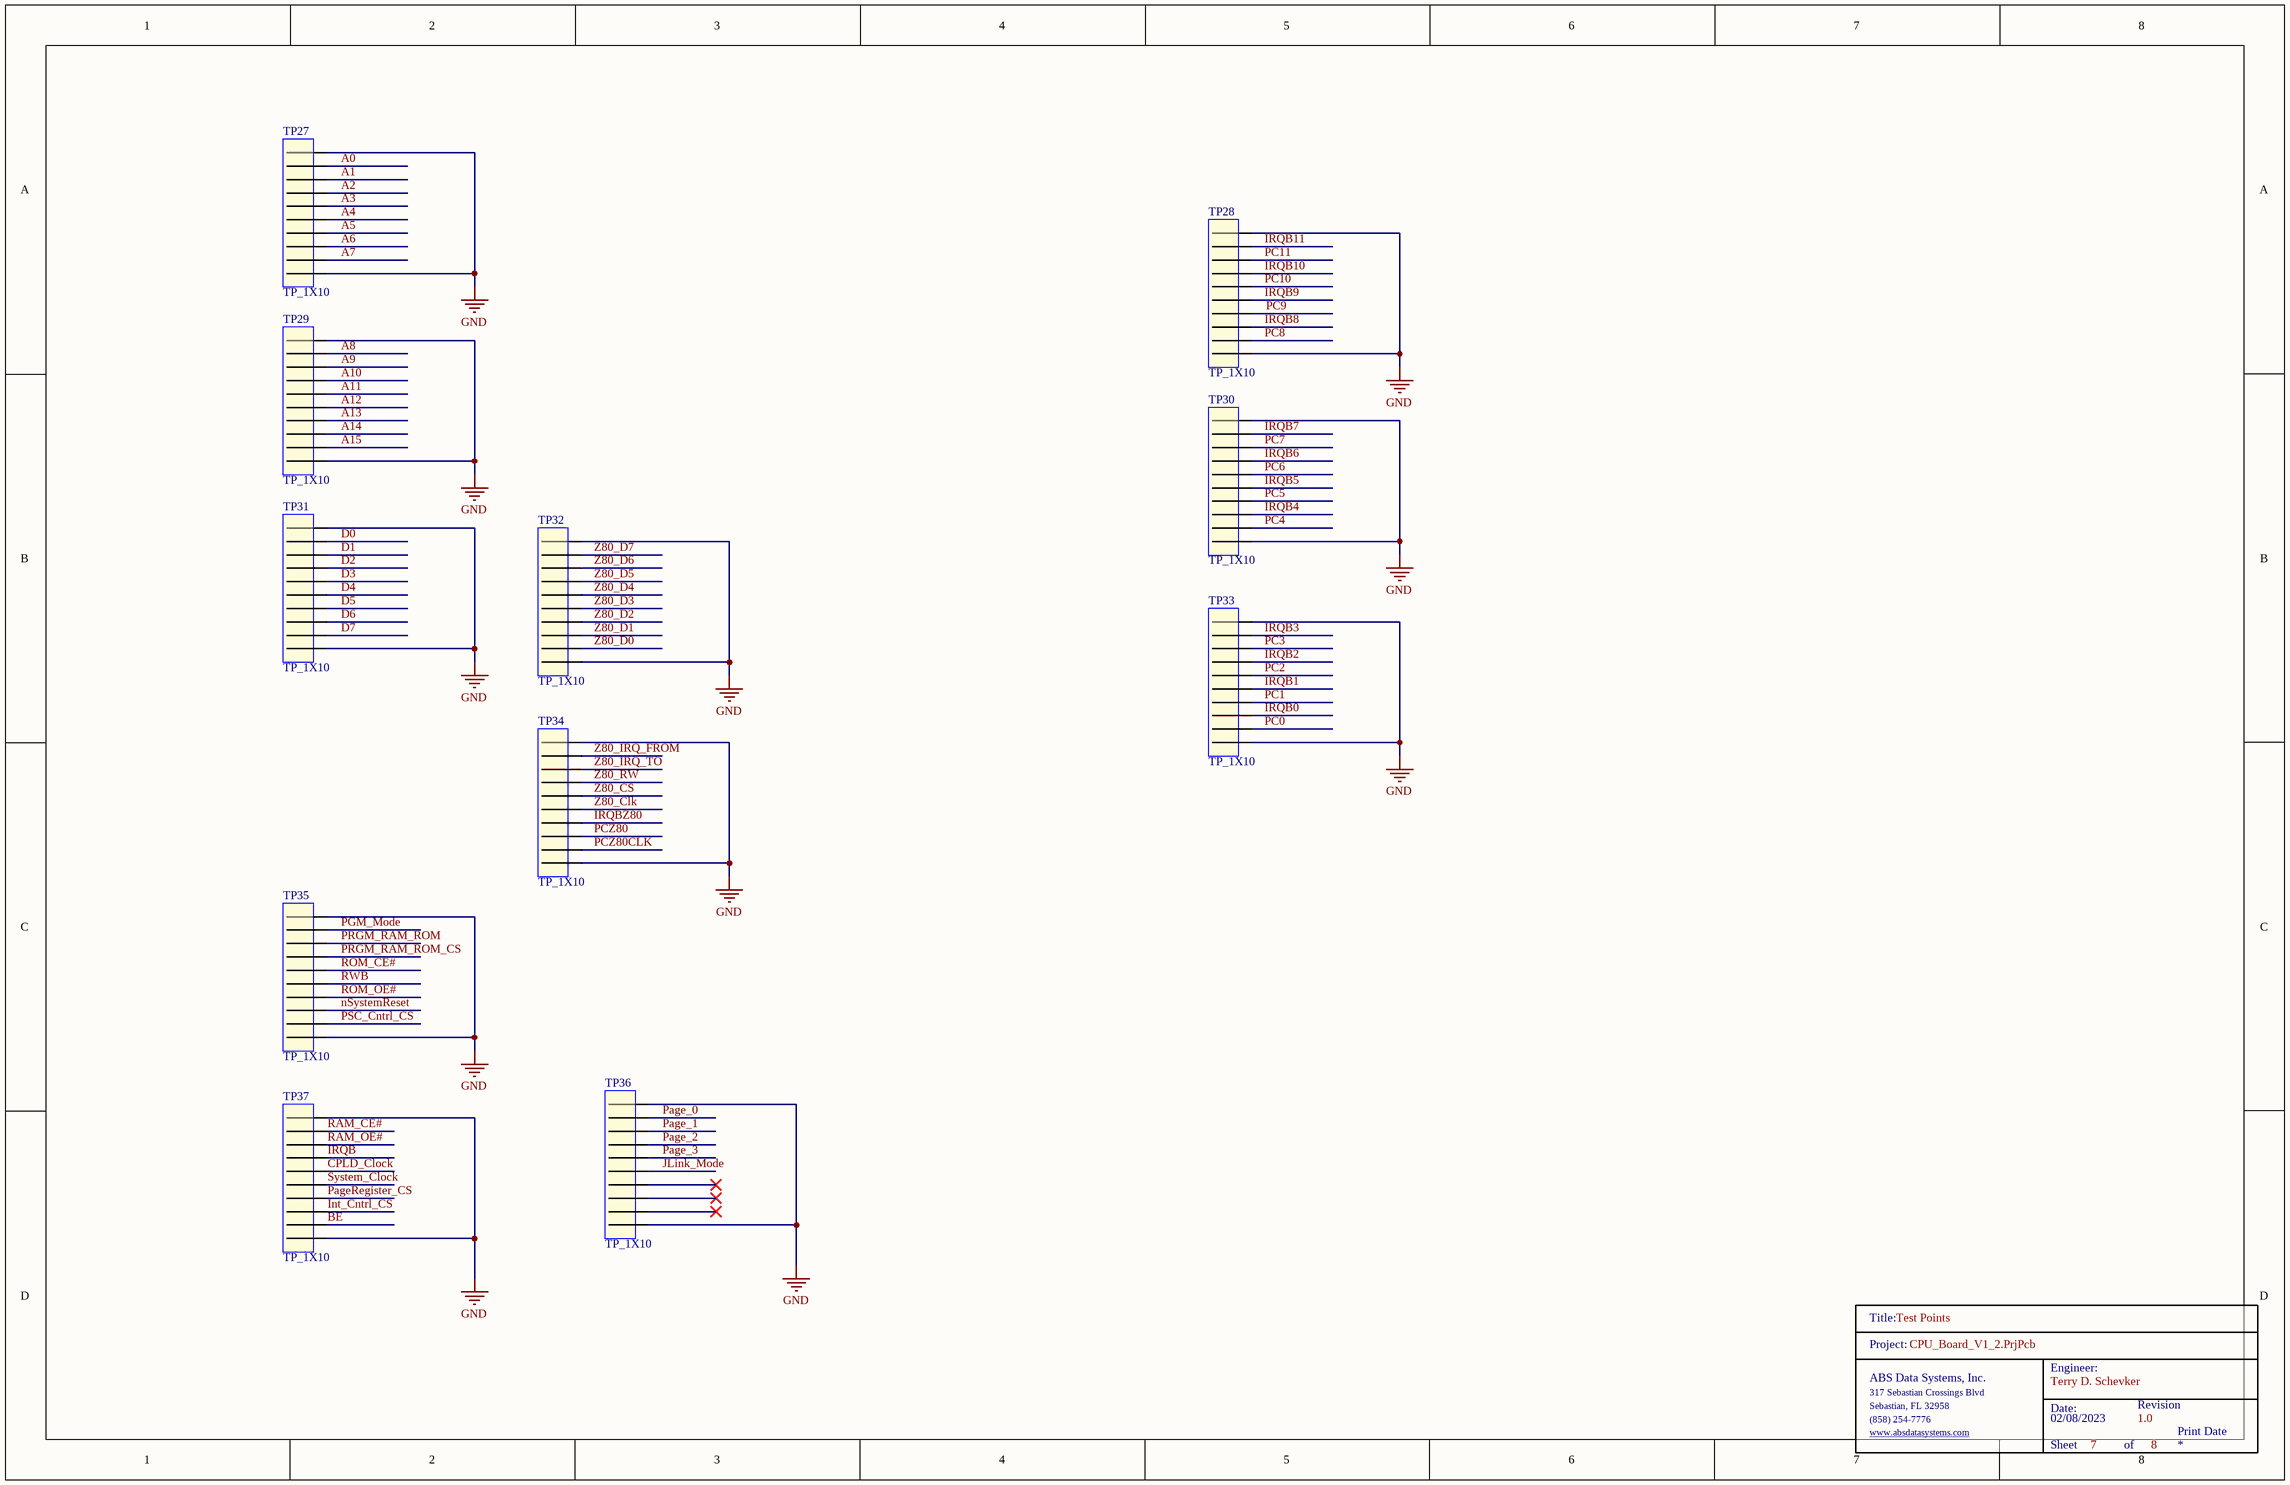
[diagram p6: TestPoints.SchDoc]

### Parts
TitleBlock_5  TitleBlock  (value not drawn)  (graphical)
TP27  TP_1X10  [TP_1X10]
TP28  TP_1X10  [TP_1X10]
TP29  TP_1X10  [TP_1X10]
TP30  TP_1X10  [TP_1X10]
TP31  TP_1X10  [TP_1X10]
TP32  TP_1X10  [TP_1X10]
TP33  TP_1X10  [TP_1X10]
TP34  TP_1X10  [TP_1X10]
TP35  TP_1X10  [TP_1X10]
TP36  TP_1X10  [TP_1X10]
TP37  TP_1X10  [TP_1X10]

### Nets
GND: TP27.1 TP27.10 TP28.1 TP28.10 TP29.1 TP29.10 TP30.1 TP30.10 TP31.1 TP31.10 TP32.1 TP32.10 TP33.1 TP33.10 TP34.1 TP34.10 TP35.1 TP35.10 TP36.1 TP36.10 TP37.1 TP37.10
A0: TP27.2
A1: TP27.3
A2: TP27.4
A3: TP27.5
A4: TP27.6
A5: TP27.7
A6: TP27.8
A7: TP27.9
A8: TP29.2
A9: TP29.3
A10: TP29.4
A11: TP29.5
A12: TP29.6
A13: TP29.7
A14: TP29.8
A15: TP29.9
BE: TP37.9
CPLD_Clock: TP37.5
D0: TP31.2
D1: TP31.3
D2: TP31.4
D3: TP31.5
D4: TP31.6
D5: TP31.7
D6: TP31.8
D7: TP31.9
Int_Cntrl_CS: TP37.8
IRQB: TP37.4
IRQB0: TP33.8
IRQB1: TP33.6
IRQB2: TP33.4
IRQB3: TP33.2
IRQB4: TP30.8
IRQB5: TP30.6
IRQB6: TP30.4
IRQB7: TP30.2
IRQB8: TP28.8
IRQB9: TP28.6
IRQB10: TP28.4
IRQB11: TP28.2
IRQBZ80: TP34.7
JLink_Mode: TP36.6
nSystemReset: TP35.8
Page_0: TP36.2
Page_1: TP36.3
Page_2: TP36.4
Page_3: TP36.5
PageRegister_CS: TP37.7
PC0: TP33.9
PC1: TP33.7
PC2: TP33.5
PC3: TP33.3
PC4: TP30.9
PC5: TP30.7
PC6: TP30.5
PC7: TP30.3
PC8: TP28.9
PC9: TP28.7
PC10: TP28.5
PC11: TP28.3
PCZ80: TP34.8
PCZ80CLK: TP34.9
PGM_Mode: TP35.2
PRGM_RAM_ROM: TP35.3
PRGM_RAM_ROM_CS: TP35.4
PSC_Cntrl_CS: TP35.9
RAM_CE#: TP37.2
RAM_OE#: TP37.3
ROM_CE#: TP35.5
ROM_OE#: TP35.7
RWB: TP35.6
System_Clock: TP37.6
Z80_Clk: TP34.6
Z80_CS: TP34.5
Z80_D0: TP32.9
Z80_D1: TP32.8
Z80_D2: TP32.7
Z80_D3: TP32.6
Z80_D4: TP32.5
Z80_D5: TP32.4
Z80_D6: TP32.3
Z80_D7: TP32.2
Z80_IRQ_FROM: TP34.2
Z80_IRQ_TO: TP34.3
Z80_RW: TP34.4

Not connected (* = marked no-connect by the designer): TP36 7* 8* 9*

### Notes on the sheet
- Print Date
- (in symbol TitleBlock) Title:; Project:; Engineer:; ABS Data Systems, Inc.; 317 Sebastian Crossings Blvd; Sebastian, FL 32958; Date:; Revision; (858) 254-7776; www.absdatasystems.com; Sheet; of

### Library data of the parts
TP27-TP37 = TP_1X10: Manufacturer: Samtec; Manufacturer Part Number: TST-105-01-G-D; Number of Contacts: 16; Gender: Male; Connector Type: Male Pin; Pitch: 2.54mm; Row Spacing: 0.1inch; Supplier 1: Digi-Key; RoHS: Yes; Category: Headers and Wire Housings; Stock 1: 227; Pricing 1: 1=2.85000, 10=2.73600, 100=2.28000, 500=1.93800, 1000=1.65300, 5000=1.48200 (USD); Mount: Through Hole; Contact Plating: Gold; Contact Material: Bronze; Housing Material: Polyester; Housing Color: Black; Color: Black; Min Operating Temperature: -55°C; Max Operating Temperature: 125°C; Number of Rows: 2; Termination: Solder; Packaging: Rail/Tube; Orientation: Straight; Number of Positions: 16; Length: 27.94mm; Depth: 9.27mm; Contact Mating Length: 0.25inch; REACH SVHC: No SVHC; ComponentLink1URL: https://datasheet.ciiva.com/739/tst-mkt-739845.pdf?src-supplier=Digi-Key; ComponentLink1Description: https://datasheet.ciiva.com/739/tst-mkt-739845.pdf?src-supplier=Digi-Key; ComponentLink2URL: https://datasheet.ciiva.com/10018/htst-10018510.pdf?src-supplier=Avnet; ComponentLink2Description: https://datasheet.ciiva.com/10018/htst-10018510.pdf?src-supplier=Avnet

## Sheet Z80_Interface.SchDoc: Z80 Interface
size Tabloid; Date: 08/05/2023; Engineer: Terry D. Schevker; Revision: 1.0; SheetNumber: 8; SheetTotal: 8
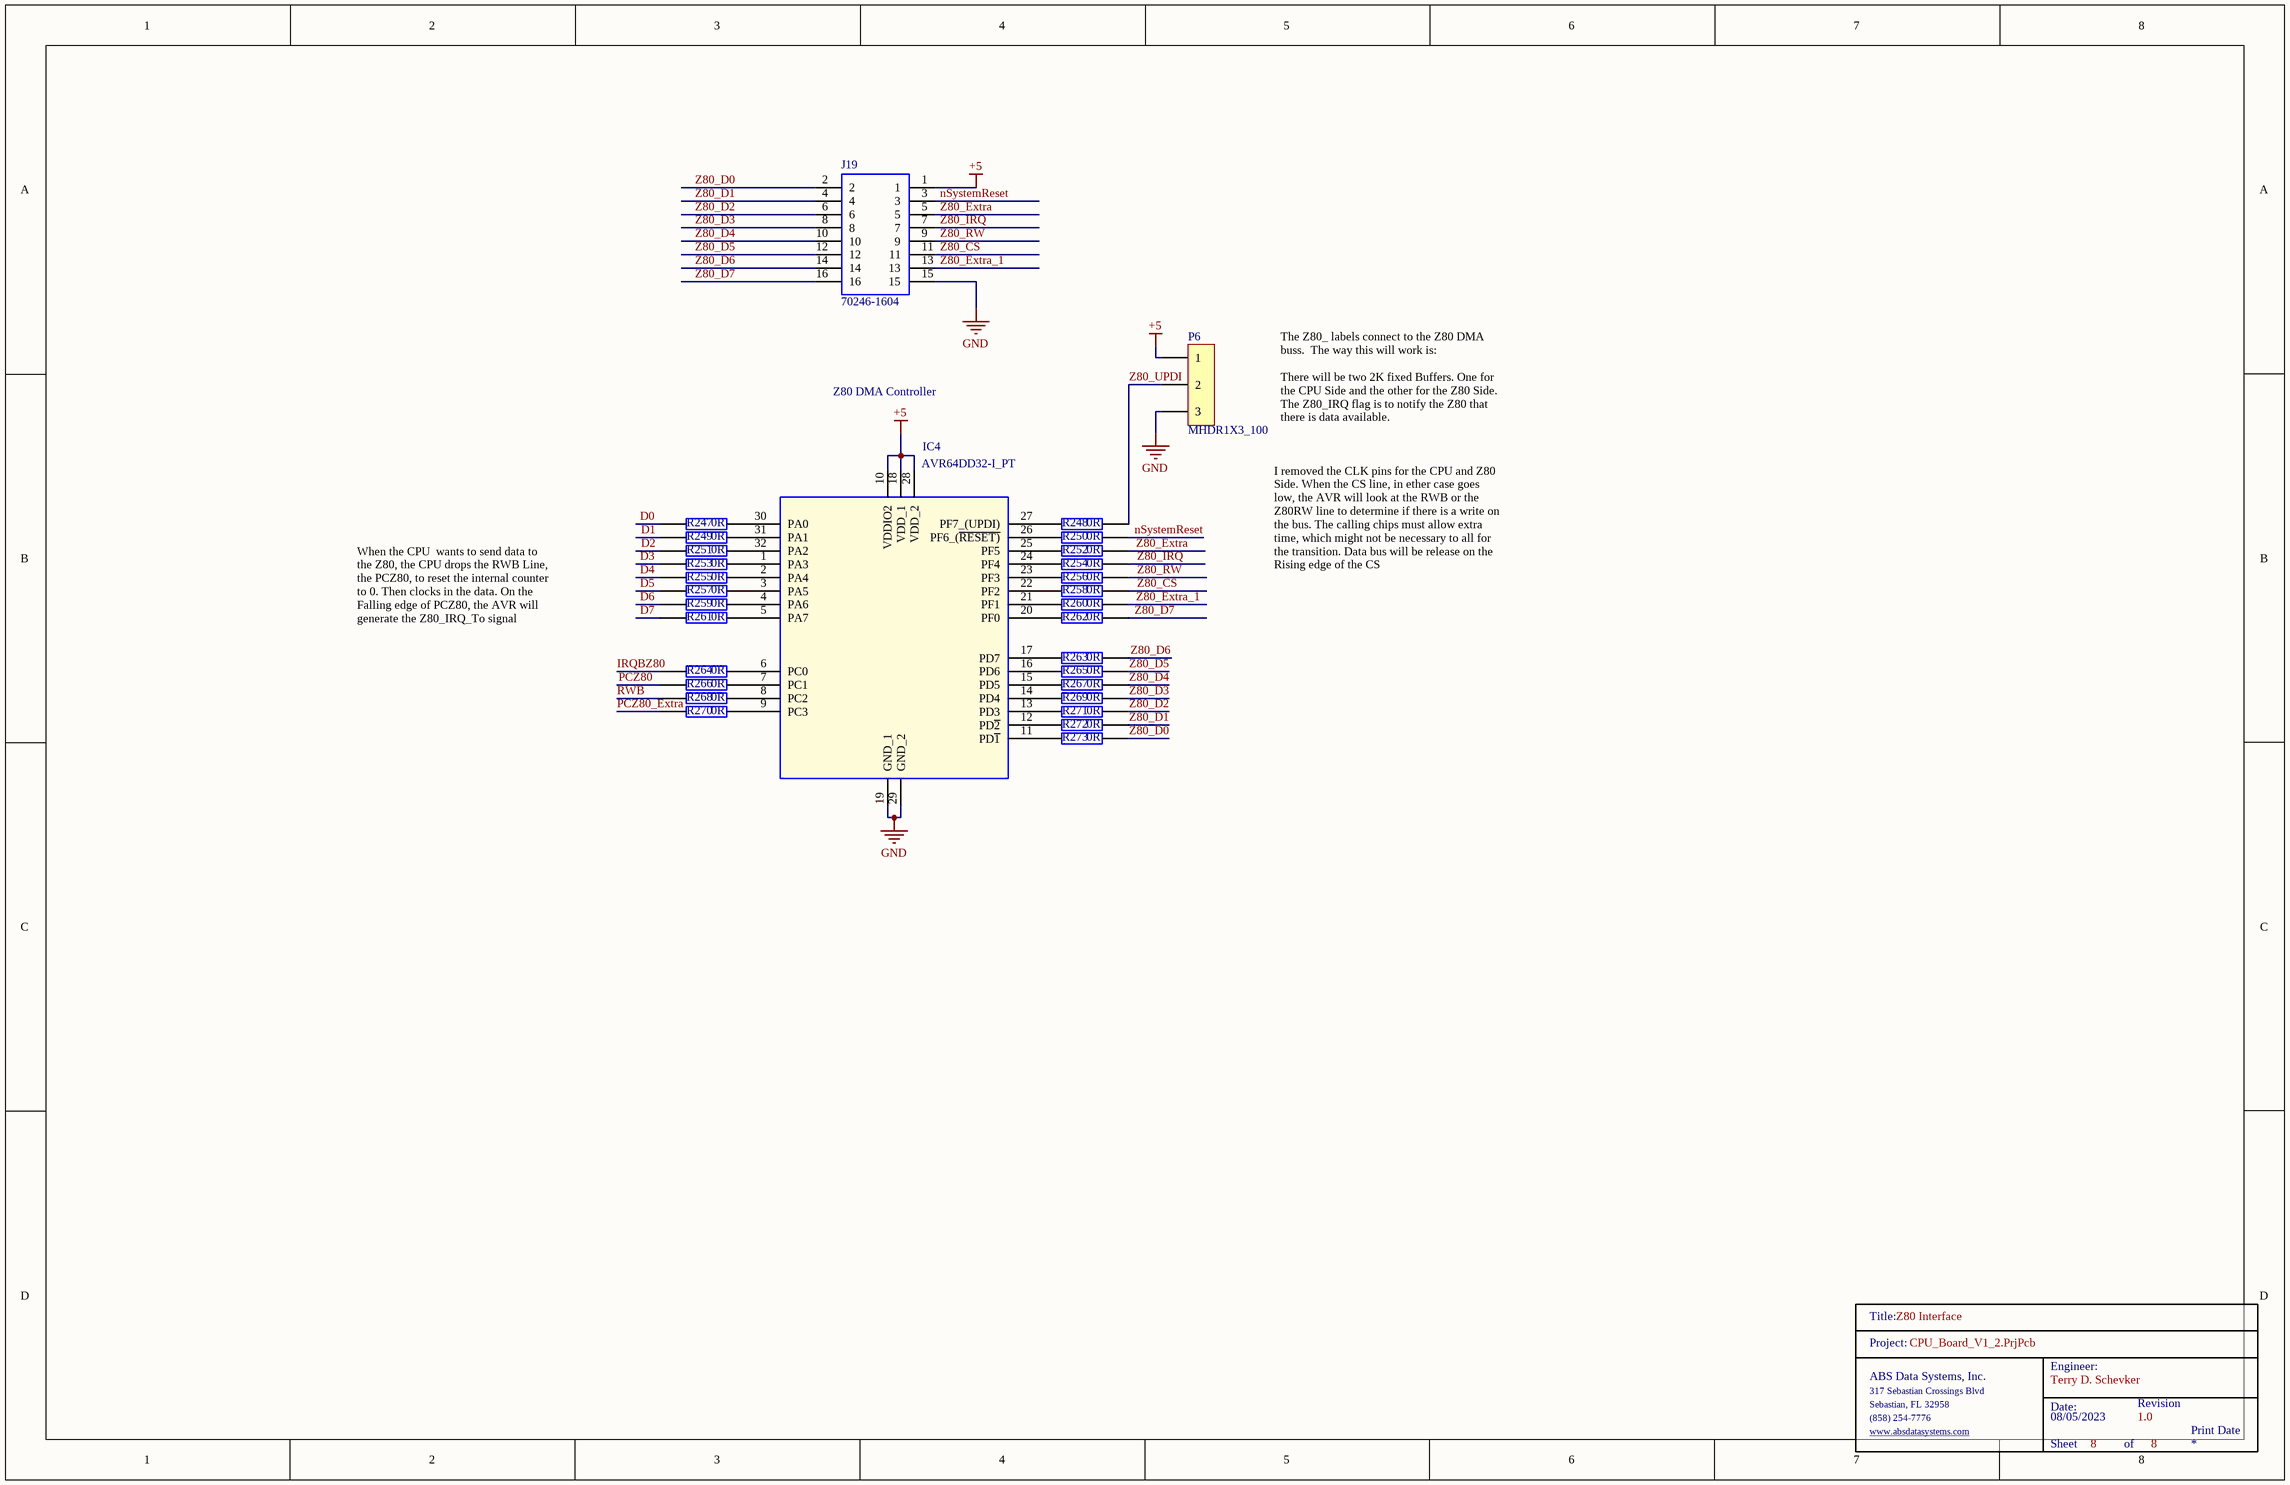
[diagram p7: Z80_Interface.SchDoc]

### Parts
(Parts that share a designator on the sheet are numbered #1, #2 ... from top to bottom, then left to right.)
IC4  AVR64DD32-I_PT  [QFP80P900X900X120-32N]
J19  70246-1604  [SHDR16W99P254_2X8_2794X889X927P]
P6  MHDR1X3_100  [MHDR1X3_100]
R247  0R  [0603]
R248  0R  [0603]
R249  0R  [0603]
R250  0R  [0603]
R251  0R  [0603]
R252  0R  [0603]
R253  0R  [0603]
R254  0R  [0603]
R255  0R  [0603]
R256  0R  [0603]
R257  0R  [0603]
R258  0R  [0603]
R259  0R  [0603]
R260  0R  [0603]
R261  0R  [0603]
R262  0R  [0603]
R263  0R  [0603]
R264  0R  [0603]
R265  0R  [0603]
R266  0R  [0603]
R267  0R  [0603]
R268  0R  [0603]
R269  0R  [0603]
R270  0R  [0603]
R271  0R  [0603]
R272  0R  [0603]
R273  0R  [0603]
TitleBlock_6#2  TitleBlock  (value not drawn)  (graphical)

### Nets
+5: IC4.10(VDDIO2) IC4.18(VDD_1) IC4.28(VDD_2) J19.1 P6.1
GND: IC4.19(GND_1) IC4.29(GND_2) J19.15 P6.3
D0: R247.1
D1: R249.1
D2: R251.1
D3: R253.1
D4: R255.1
D5: R257.1
D6: R259.1
D7: R261.1
IRQBZ80: R264.1
nSystemReset: J19.3 R250.2
PCZ80: R266.1
PCZ80_Extra: R270.1
RWB: R268.1
Z80_CS: J19.11 R258.2
Z80_D0: J19.2 R273.2
Z80_D1: J19.4 R272.2
Z80_D2: J19.6 R271.2
Z80_D3: J19.8 R269.2
Z80_D4: J19.10 R267.2
Z80_D5: J19.12 R265.2
Z80_D6: J19.14 R263.2
Z80_D7: J19.16 R262.2
Z80_Extra: J19.5 R252.2
Z80_Extra_1: J19.13 R260.2
Z80_IRQ: J19.7 R254.2
Z80_RW: J19.9 R256.2
Z80_UPDI: P6.2 R248.2
NetIC4_1: IC4.1(PA3) R253.2
NetIC4_2: IC4.2(PA4) R255.2
NetIC4_3: IC4.3(PA5) R257.2
NetIC4_4: IC4.4(PA6) R259.2
NetIC4_5: IC4.5(PA7) R261.2
NetIC4_6: IC4.6(PC0) R264.2
NetIC4_7: IC4.7(PC1) R266.2
NetIC4_8: IC4.8(PC2) R268.2
NetIC4_9: IC4.9(PC3) R270.2
NetIC4_11: IC4.11(PD~{1}) R273.1
NetIC4_12: IC4.12(PD~{2}) R272.1
NetIC4_13: IC4.13(PD3) R271.1
NetIC4_14: IC4.14(PD4) R269.1
NetIC4_15: IC4.15(PD5) R267.1
NetIC4_16: IC4.16(PD6) R265.1
NetIC4_17: IC4.17(PD7) R263.1
NetIC4_20: IC4.20(PF0) R262.1
NetIC4_21: IC4.21(PF1) R260.1
NetIC4_22: IC4.22(PF2) R258.1
NetIC4_23: IC4.23(PF3) R256.1
NetIC4_24: IC4.24(PF4) R254.1
NetIC4_25: IC4.25(PF5) R252.1
NetIC4_26: IC4.26(PF6_(~{RESET)}) R250.1
NetIC4_27: IC4.27(PF7_(UPDI)) R248.1
NetIC4_30: IC4.30(PA0) R247.2
NetIC4_31: IC4.31(PA1) R249.2
NetIC4_32: IC4.32(PA2) R251.2

### Notes on the sheet
- The Z80_ labels connect to the Z80 DMA buss.  The way this will work is:
- Z80 DMA Controller
- There will be two 2K fixed Buffers. One for the CPU Side and the other for the Z80 Side. The Z80_IRQ flag is to notify the Z80 that there is data available.
- When the CPU  wants to send data to the Z80, the CPU drops the RWB Line, the PCZ80, to reset the internal counter to 0. Then clocks in the data. On the Falling edge of PCZ80, the AVR will generate the Z80_IRQ_To signal
- I removed the CLK pins for the CPU and Z80 Side. When the CS line, in ether case goes low, the AVR will look at the RWB or the Z80RW line to determine if there is a write on the bus. The calling chips must allow extra time, which might not be necessary to all for the transition. Data bus will be release on the Rising edge of the CS
- Print Date
- (in symbol TitleBlock) Title:; Project:; Engineer:; ABS Data Systems, Inc.; 317 Sebastian Crossings Blvd; Sebastian, FL 32958; Date:; Revision; (858) 254-7776; www.absdatasystems.com; Sheet; of

### Library data of the parts
IC4 = AVR64DD32-I_PT: as IC2 on sheet Peripherial_Bus; Datasheet Link: https://www.microchip.com/en-us/product/AVR64DD32; Height: 1.2mm
J19 = 70246-1604: as PC_0 on sheet Peripherial_Bus; Mouser Part Number: 538-70246-1604; Mouser Price/Stock: https://www.mouser.co.uk/ProductDetail/Molex/70246-1604?qs=KUIzHt%2Fe91njhb67Cjmalw%3D%3D; Manufacturer_Name: Molex; Manufacturer_Part_Number: 70246-1604; Datasheet Link: https://www.molex.com/pdm_docs/sd/702461604_sd.pdf
P6 = MHDR1X3_100: Header, 3-Pin; LatestRevisionDate: 17-Jul-2002; LatestRevisionNote: Re-released for DXP Platform.; Publisher: Altium Limited
R247-R273 = RC0603JR-070RL: as R139 on sheet PowerSupply; Mouser Part Number: 603-RC0603JR-070RL; Mouser Price/Stock: https://www.mouser.co.uk/ProductDetail/YAGEO/RC0603JR-070RL?qs=2cAdsCoAWRGWyPcuXgGiXQ%3D%3D; Manufacturer_Part_Number: RC0603JR-070RL; Datasheet Link: https://datasheet.datasheetarchive.com/originals/distributors/Datasheets_SAMA/902f9e387b938f871d31120f5fc1d65e.pdf

## Nets that join several sheets
+3.3: Peripherial_Bus (12 pins), PowerSupply (6 pins)
+5: CPU_Board (22 pins), LED_Monitor (53 pins), LED_Monitor_2 (31 pins), Peripherial_Bus (20 pins), PowerSupply (33 pins), Programmer_Interface (J2.1), Z80_Interface (5 pins)
GND: CPU_Board (21 pins), LED_Monitor (12 pins), LED_Monitor_2 (6 pins), Peripherial_Bus (30 pins), PowerSupply (31 pins), Programmer_Interface (31 pins), TestPoints (22 pins), Z80_Interface (IC4.19 IC4.29 J19.15 P6.3)
A0: CPU_Board (U1.4 U2.21 U3.12 U4.37), LED_Monitor (U5.2), Programmer_Interface (J4.14), TestPoints (TP27.2)
A1: CPU_Board (U1.5 U2.23 U3.11 U4.28), LED_Monitor (U5.4), Programmer_Interface (J4.12), TestPoints (TP27.3)
A2: CPU_Board (U1.7 U2.24 U3.10 U4.29), LED_Monitor (U5.6), Programmer_Interface (J4.10), TestPoints (TP27.4)
A3: CPU_Board (U1.8 U2.25 U3.9 U4.31), LED_Monitor (U5.8), Programmer_Interface (J4.8), TestPoints (TP27.5)
A4: CPU_Board (U1.9 U2.26 U3.8 U4.33), LED_Monitor (U5.11), Programmer_Interface (J4.6), TestPoints (TP27.6)
A5: CPU_Board (U1.10 U2.1 U3.7 U4.34), LED_Monitor (U5.13), Programmer_Interface (J4.4), TestPoints (TP27.7)
A6: CPU_Board (U1.11 U2.2 U3.6 U4.36), LED_Monitor (U5.15), Programmer_Interface (J4.2), TestPoints (TP27.8)
A7: CPU_Board (B1.1 U1.12 U2.3 U3.5), LED_Monitor (U5.17), Programmer_Interface (J3.16), TestPoints (TP27.9)
A8: CPU_Board (B1.2 U1.13 U2.4 U3.27), LED_Monitor (U6.2), Programmer_Interface (J3.14), TestPoints (TP29.2)
A9: CPU_Board (B1.4 U1.14 U2.5 U3.26), LED_Monitor (U6.4), Programmer_Interface (J3.12), TestPoints (TP29.3)
A10: CPU_Board (B1.5 U1.15 U2.6 U3.23), LED_Monitor (U6.6), Programmer_Interface (J3.10), TestPoints (TP29.4)
A11: CPU_Board (B1.13 U1.16 U2.7 U3.25), LED_Monitor (U6.8), Programmer_Interface (J3.8), TestPoints (TP29.5)
A12: CPU_Board (B1.12 U1.19 U2.8 U3.4), LED_Monitor (U6.11), Programmer_Interface (J3.6), TestPoints (TP29.6)
A13: CPU_Board (B1.10 U1.20 U2.9 U3.28), LED_Monitor (U6.13), Programmer_Interface (J3.4), TestPoints (TP29.7)
A14: CPU_Board (B1.9 U1.21 U2.10 U3.29), LED_Monitor (U6.15), Programmer_Interface (J3.2), TestPoints (TP29.8)
A15: CPU_Board (U1.22 U4.27), LED_Monitor (U6.17), Programmer_Interface (J4.16), TestPoints (TP29.9)
BE: CPU_Board (R4.1 R7.1 U4.12), LED_Monitor (U8.11), TestPoints (TP37.9)
CPLD_Clock: CPU_Board (U4.43), PowerSupply (P8.2), TestPoints (TP37.5)
D0: CPU_Board (U1.30 U2.11 U3.13), LED_Monitor (U7.2), Peripherial_Bus (13 pins), Programmer_Interface (J5.2), TestPoints (TP31.2), Z80_Interface (R247.1)
D1: CPU_Board (U1.29 U2.12 U3.14), LED_Monitor (U7.4), Peripherial_Bus (13 pins), Programmer_Interface (J5.4), TestPoints (TP31.3), Z80_Interface (R249.1)
D2: CPU_Board (U1.28 U2.13 U3.15), LED_Monitor (U7.6), Peripherial_Bus (13 pins), Programmer_Interface (J5.6), TestPoints (TP31.4), Z80_Interface (R251.1)
D3: CPU_Board (U1.27 U2.15 U3.17), LED_Monitor (U7.8), Peripherial_Bus (13 pins), Programmer_Interface (J5.8), TestPoints (TP31.5), Z80_Interface (R253.1)
D4: CPU_Board (U1.26 U2.16 U3.18), LED_Monitor (U7.11), Peripherial_Bus (12 pins), Programmer_Interface (J5.10), TestPoints (TP31.6), Z80_Interface (R255.1)
D5: CPU_Board (U1.25 U2.17 U3.19), LED_Monitor (U7.13), Peripherial_Bus (12 pins), Programmer_Interface (J5.12), TestPoints (TP31.7), Z80_Interface (R257.1)
D6: CPU_Board (U1.24 U2.18 U3.20), LED_Monitor (U7.15), Peripherial_Bus (12 pins), Programmer_Interface (J5.14), TestPoints (TP31.8), Z80_Interface (R259.1)
D7: CPU_Board (U1.23 U2.19 U3.21), LED_Monitor (U7.17), Peripherial_Bus (12 pins), Programmer_Interface (J5.16), TestPoints (TP31.9), Z80_Interface (R261.1)
Int_Cntrl_CS: CPU_Board (U4.25), LED_Monitor_2 (R296.1), Peripherial_Bus (IC2.31), TestPoints (TP37.8)
IRQB: CPU_Board (R3.1 R11.1), LED_Monitor (R138.1), Peripherial_Bus (IC2.30), TestPoints (TP37.4)
IRQB0: LED_Monitor (R111.1), Peripherial_Bus (IC2.25 PC_0.5), TestPoints (TP33.8)
IRQB1: LED_Monitor (R110.1), Peripherial_Bus (IC2.24 PC_1.5), TestPoints (TP33.6)
IRQB2: LED_Monitor (R109.1), Peripherial_Bus (IC2.23 PC_2.5), TestPoints (TP33.4)
IRQB3: LED_Monitor (R108.1), Peripherial_Bus (IC2.22 PC_3.5), TestPoints (TP33.2)
IRQB4: LED_Monitor (R107.1), Peripherial_Bus (IC2.21 PC_4.5), TestPoints (TP30.8)
IRQB5: LED_Monitor (R106.1), Peripherial_Bus (IC2.20 PC_5.5), TestPoints (TP30.6)
IRQB6: LED_Monitor (R105.1), Peripherial_Bus (IC2.17 PC_6.5), TestPoints (TP30.4)
IRQB7: LED_Monitor (R104.1), Peripherial_Bus (IC2.16 PC_7.5), TestPoints (TP30.2)
IRQB8: LED_Monitor_2 (R293.1), Peripherial_Bus (IC2.15 PC_8.5), TestPoints (TP28.8)
IRQB9: LED_Monitor_2 (R291.1), Peripherial_Bus (IC2.14 PC_9.5), TestPoints (TP28.6)
IRQB10: LED_Monitor_2 (R289.1), Peripherial_Bus (IC2.13 PC_10.5), TestPoints (TP28.4)
IRQB11: LED_Monitor_2 (R287.1), Peripherial_Bus (IC2.12 PC_11.5), TestPoints (TP28.2)
IRQBZ80: LED_Monitor_2 (R288.1), Peripherial_Bus (IC2.11), TestPoints (TP34.7), Z80_Interface (R264.1)
JLink_Mode: CPU_Board (R13.2 R16.1 U4.2), Programmer_Interface (R177.1), TestPoints (TP36.6)
nSystemReset: CPU_Board (R58.2), LED_Monitor (R137.1), Peripherial_Bus (14 pins), TestPoints (TP35.8), Z80_Interface (J19.3 R250.2)
Page_0: CPU_Board (IC1.20 U3.3), LED_Monitor (U8.2), TestPoints (TP36.2)
Page_1: CPU_Board (IC1.21 U3.2), LED_Monitor (U8.4), TestPoints (TP36.3)
Page_2: CPU_Board (IC1.22 U3.30), LED_Monitor (U8.6), TestPoints (TP36.4)
Page_3: CPU_Board (IC1.23 U3.1), LED_Monitor (U8.8), TestPoints (TP36.5)
Page_Register: CPU_Board (R12.2 R15.1 U4.1), Programmer_Interface (R185.1)
PageRegister_CS: CPU_Board (IC1.30 U4.9), TestPoints (TP37.7)
PC0: LED_Monitor (R134.1), Peripherial_Bus (IC3.25 PC_0.9), TestPoints (TP33.9)
PC1: LED_Monitor (R133.1), Peripherial_Bus (IC3.24 PC_1.9), TestPoints (TP33.7)
PC2: LED_Monitor (R132.1), Peripherial_Bus (IC3.23 PC_2.9), TestPoints (TP33.5)
PC3: LED_Monitor (R131.1), Peripherial_Bus (IC3.22 PC_3.9), TestPoints (TP33.3)
PC4: LED_Monitor (R130.1), Peripherial_Bus (IC3.21 PC_4.9), TestPoints (TP30.9)
PC5: LED_Monitor (R129.1), Peripherial_Bus (IC3.20 PC_5.9), TestPoints (TP30.7)
PC6: LED_Monitor (R128.1), Peripherial_Bus (IC3.17 PC_6.9), TestPoints (TP30.5)
PC7: LED_Monitor (R127.1), Peripherial_Bus (IC3.16 PC_7.9), TestPoints (TP30.3)
PC8: LED_Monitor_2 (R299.1), Peripherial_Bus (IC3.15 PC_8.9), TestPoints (TP28.9)
PC9: LED_Monitor_2 (R298.1), Peripherial_Bus (IC3.14 PC_9.9), TestPoints (TP28.7)
PC10: LED_Monitor_2 (R297.1), Peripherial_Bus (IC3.13 PC_10.9), TestPoints (TP28.5)
PC11: LED_Monitor_2 (R295.1), Peripherial_Bus (IC3.12 PC_11.9), TestPoints (TP28.3)
PCZ80: LED_Monitor_2 (U11.15), Peripherial_Bus (IC3.11), TestPoints (TP34.8), Z80_Interface (R266.1)
PCZ80_Extra: CPU_Board (TP57.1 U4.41), Z80_Interface (R270.1)
PCZ80CLK: LED_Monitor_2 (U11.13), TestPoints (TP34.9)
PGM_Mode: CPU_Board (IC1.13 U4.8), LED_Monitor_2 (U11.2), Programmer_Interface (R165.1), TestPoints (TP35.2)
POW_Reset: CPU_Board (5 pins), Programmer_Interface (R189.1)
PRGM_RAM_ROM: CPU_Board (U4.5), LED_Monitor_2 (U11.4), Programmer_Interface (R169.1), TestPoints (TP35.3)
PRGM_RAM_ROM_CS: CPU_Board (U4.6), LED_Monitor_2 (U11.6), Programmer_Interface (R173.1), TestPoints (TP35.4)
PSC_Cntrl_CS: CPU_Board (U4.14), LED_Monitor_2 (U11.17), Peripherial_Bus (IC3.31), TestPoints (TP35.9)
PSC_D0: CPU_Board (IC1.14 U4.19), Peripherial_Bus (IC3.6 TP15.1)
PSC_D1: CPU_Board (IC1.15 U4.18), Peripherial_Bus (IC3.7 TP26.1)
PSC_D2: CPU_Board (IC1.16 U4.17), Peripherial_Bus (IC3.8 TP55.1)
PSC_D3: CPU_Board (IC1.17 U4.16), Peripherial_Bus (IC3.9 TP56.1)
RAM_CE#: CPU_Board (U2.20 U4.20), TestPoints (TP37.2)
RAM_OE#: CPU_Board (U2.22 U4.21), TestPoints (TP37.3)
ROM_CE#: CPU_Board (U3.22 U4.24), TestPoints (TP35.5)
ROM_OE#: CPU_Board (U3.24 U4.26), TestPoints (TP35.7)
RWB: CPU_Board (5 pins), LED_Monitor (U8.13), Peripherial_Bus (14 pins), Programmer_Interface (R181.1), TestPoints (TP35.6), Z80_Interface (R268.1)
System_Clock: CPU_Board (R27.1), PowerSupply (P2.2 P8.1), Programmer_Interface (R192.1), TestPoints (TP37.6)
TCK: CPU_Board (U4.32), PowerSupply (R148.2 R149.1)
TDI: CPU_Board (U4.7), PowerSupply (R141.2 R155.1)
TDO: CPU_Board (U4.38), PowerSupply (R150.1)
TMS: CPU_Board (U4.13), PowerSupply (R147.2 R151.1)
Z80_Clk: LED_Monitor_2 (U11.11), TestPoints (TP34.6)
Z80_CS: LED_Monitor_2 (R294.1), TestPoints (TP34.5), Z80_Interface (J19.11 R258.2)
Z80_D0: LED_Monitor_2 (U10.2), TestPoints (TP32.9), Z80_Interface (J19.2 R273.2)
Z80_D1: LED_Monitor_2 (U10.4), TestPoints (TP32.8), Z80_Interface (J19.4 R272.2)
Z80_D2: LED_Monitor_2 (U10.6), TestPoints (TP32.7), Z80_Interface (J19.6 R271.2)
Z80_D3: LED_Monitor_2 (U10.8), TestPoints (TP32.6), Z80_Interface (J19.8 R269.2)
Z80_D4: LED_Monitor_2 (U10.11), TestPoints (TP32.5), Z80_Interface (J19.10 R267.2)
Z80_D5: LED_Monitor_2 (U10.13), TestPoints (TP32.4), Z80_Interface (J19.12 R265.2)
Z80_D6: LED_Monitor_2 (U10.15), TestPoints (TP32.3), Z80_Interface (J19.14 R263.2)
Z80_D7: LED_Monitor_2 (U10.17), TestPoints (TP32.2), Z80_Interface (J19.16 R262.2)
Z80_IRQ_FROM: LED_Monitor_2 (R290.1), TestPoints (TP34.2)
Z80_IRQ_TO: LED_Monitor_2 (R292.1), TestPoints (TP34.3)
Z80_RW: LED_Monitor_2 (U11.8), TestPoints (TP34.4), Z80_Interface (J19.9 R256.2)